# EAGLE board stm32 v1.0 (EAGLE 9.6.2), part 1 of 2
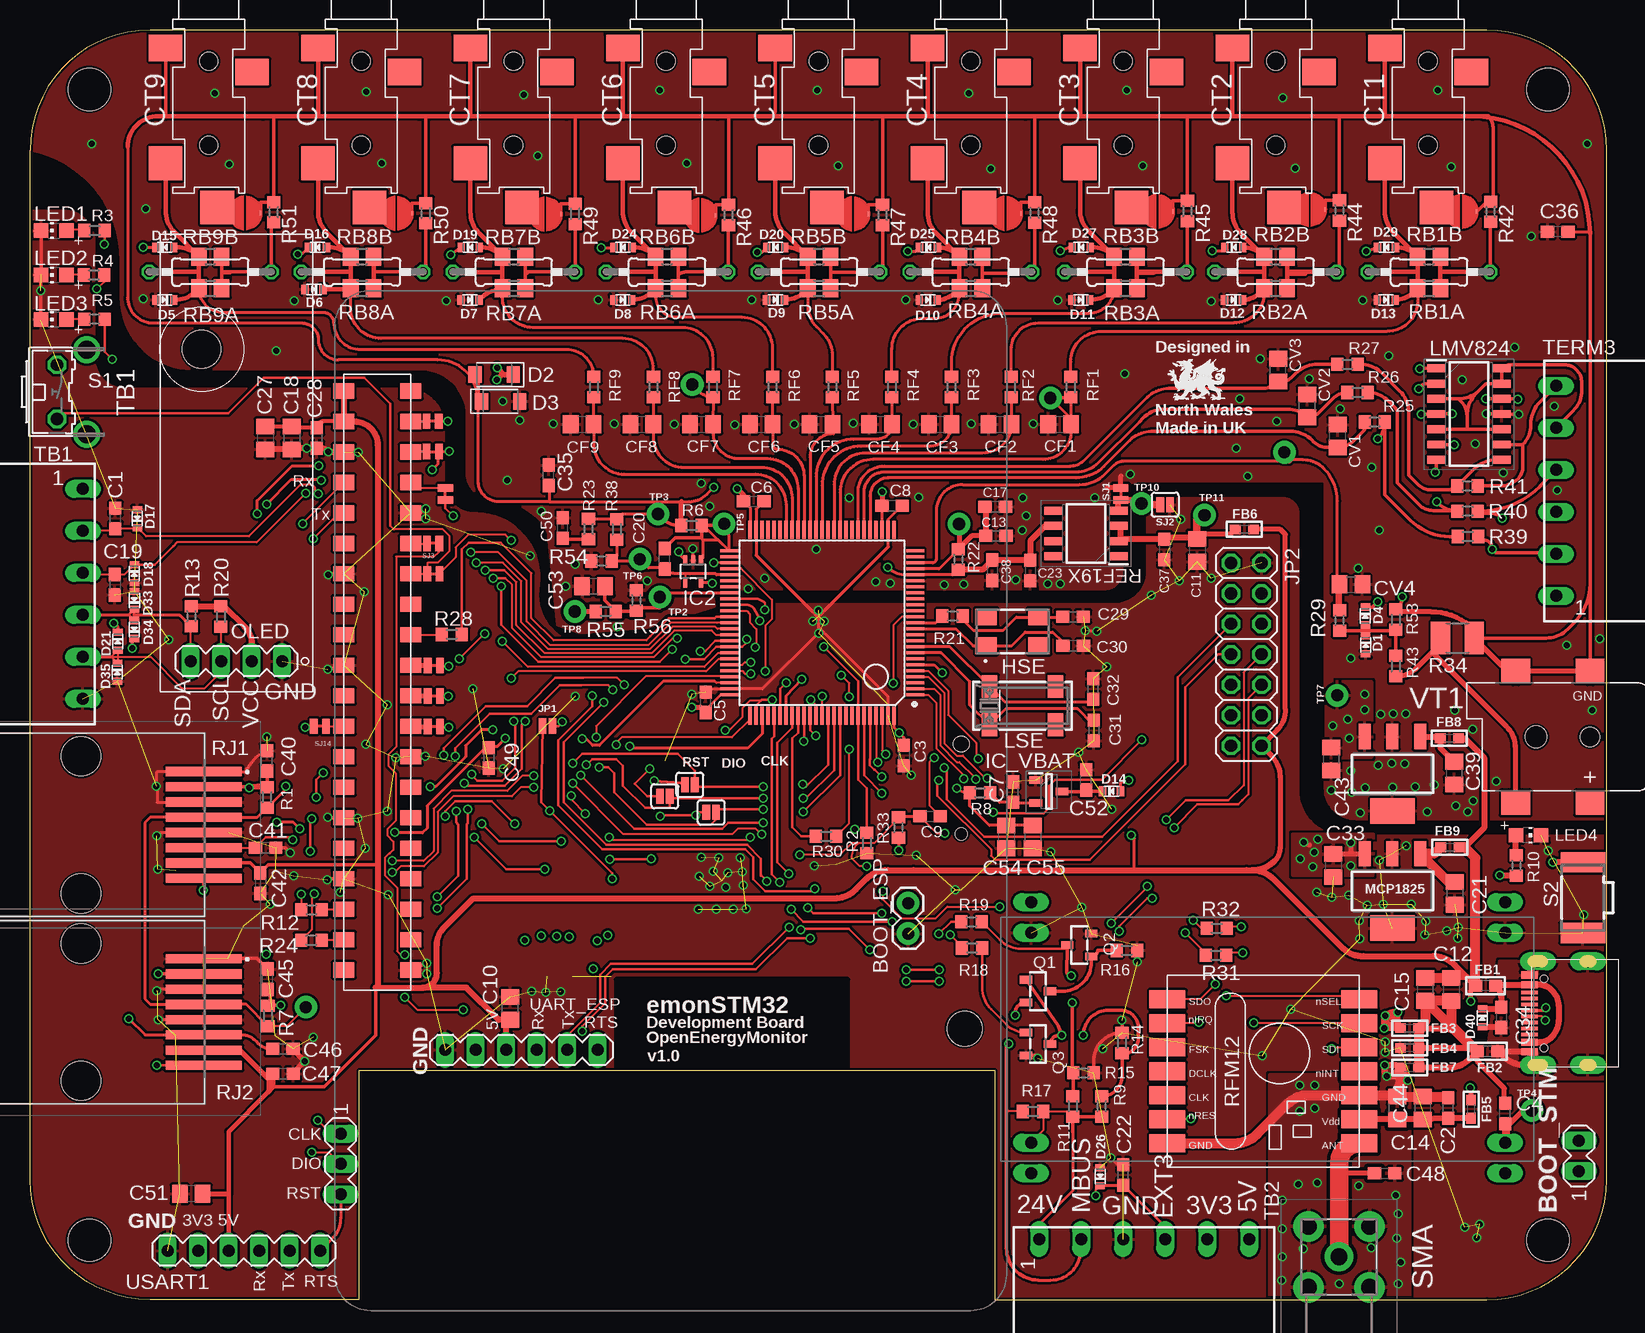
[diagram p5: board, top side]
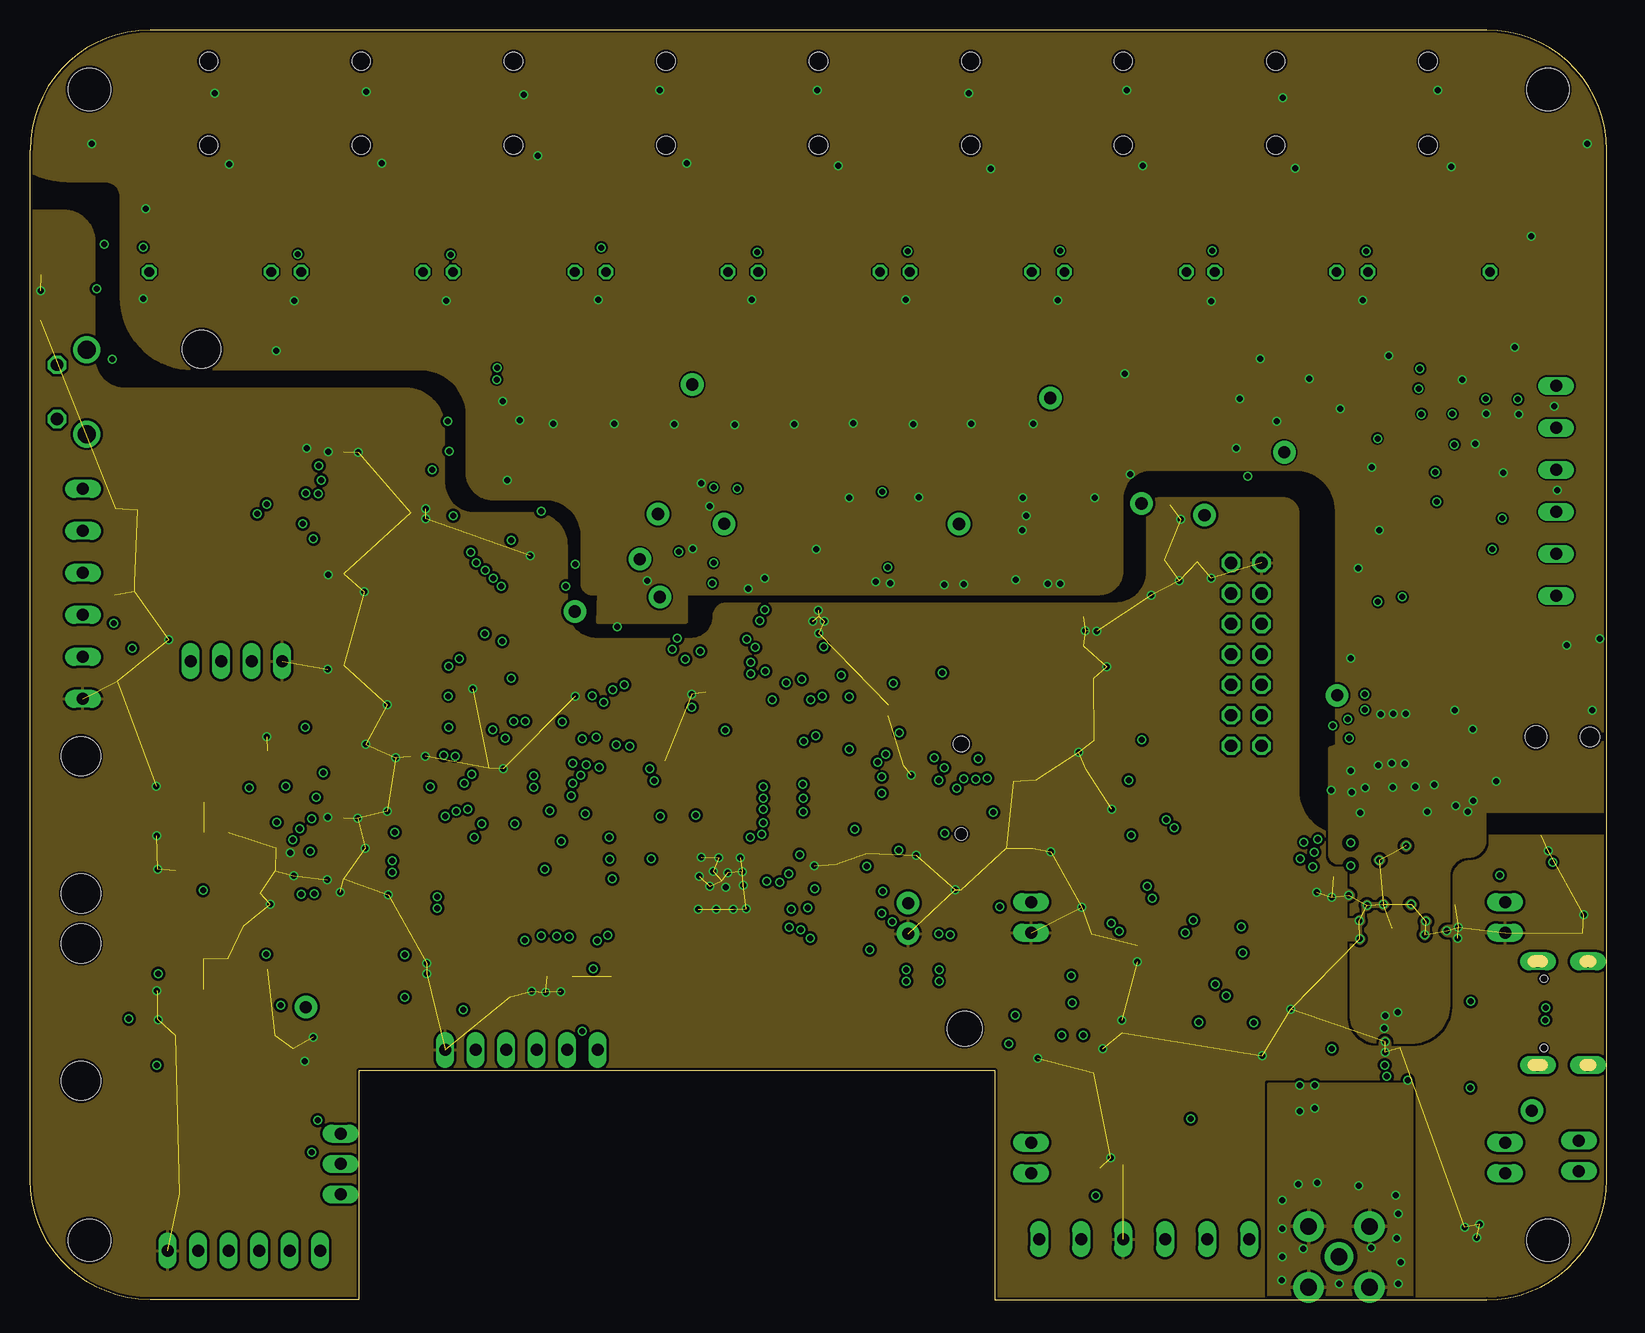
[diagram p6: board, inner layer GND]
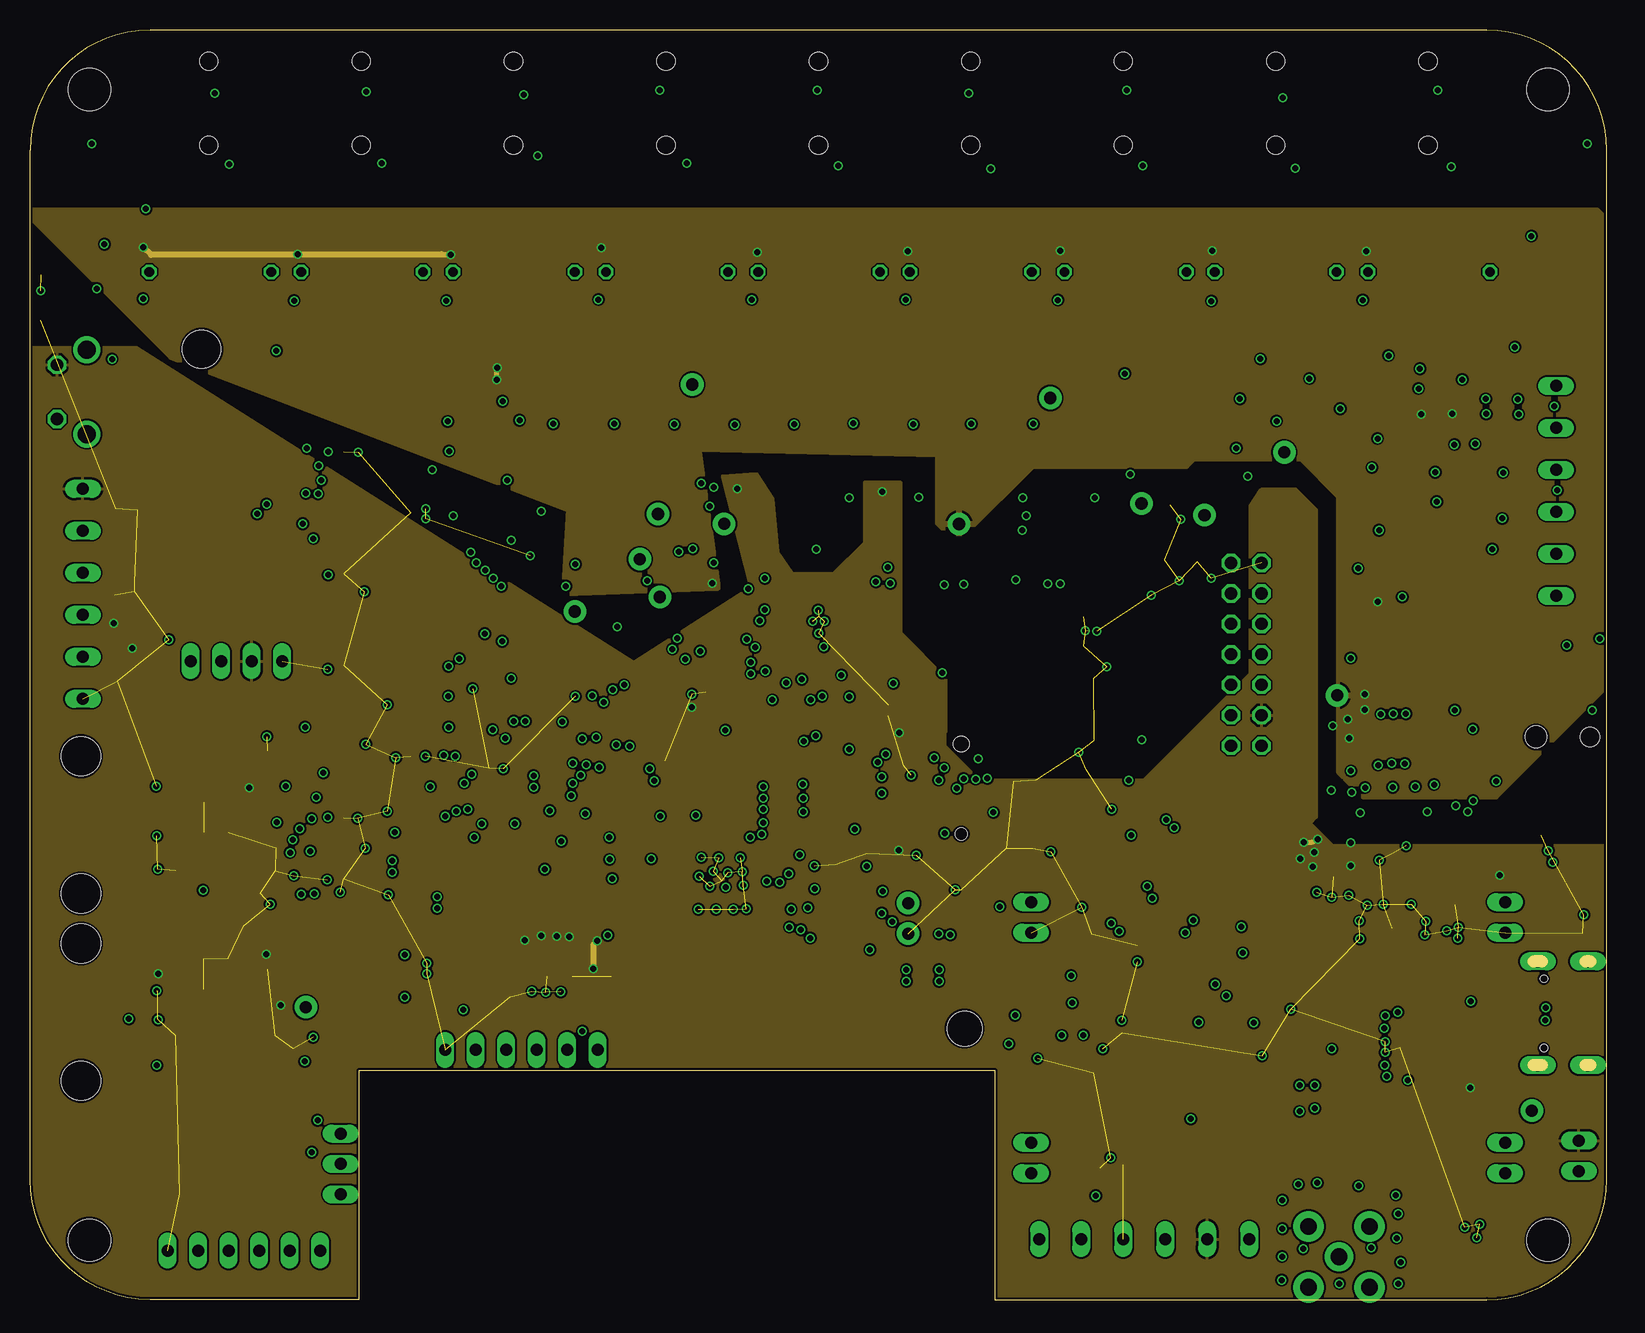
[diagram p7: board, inner layer +3V3]
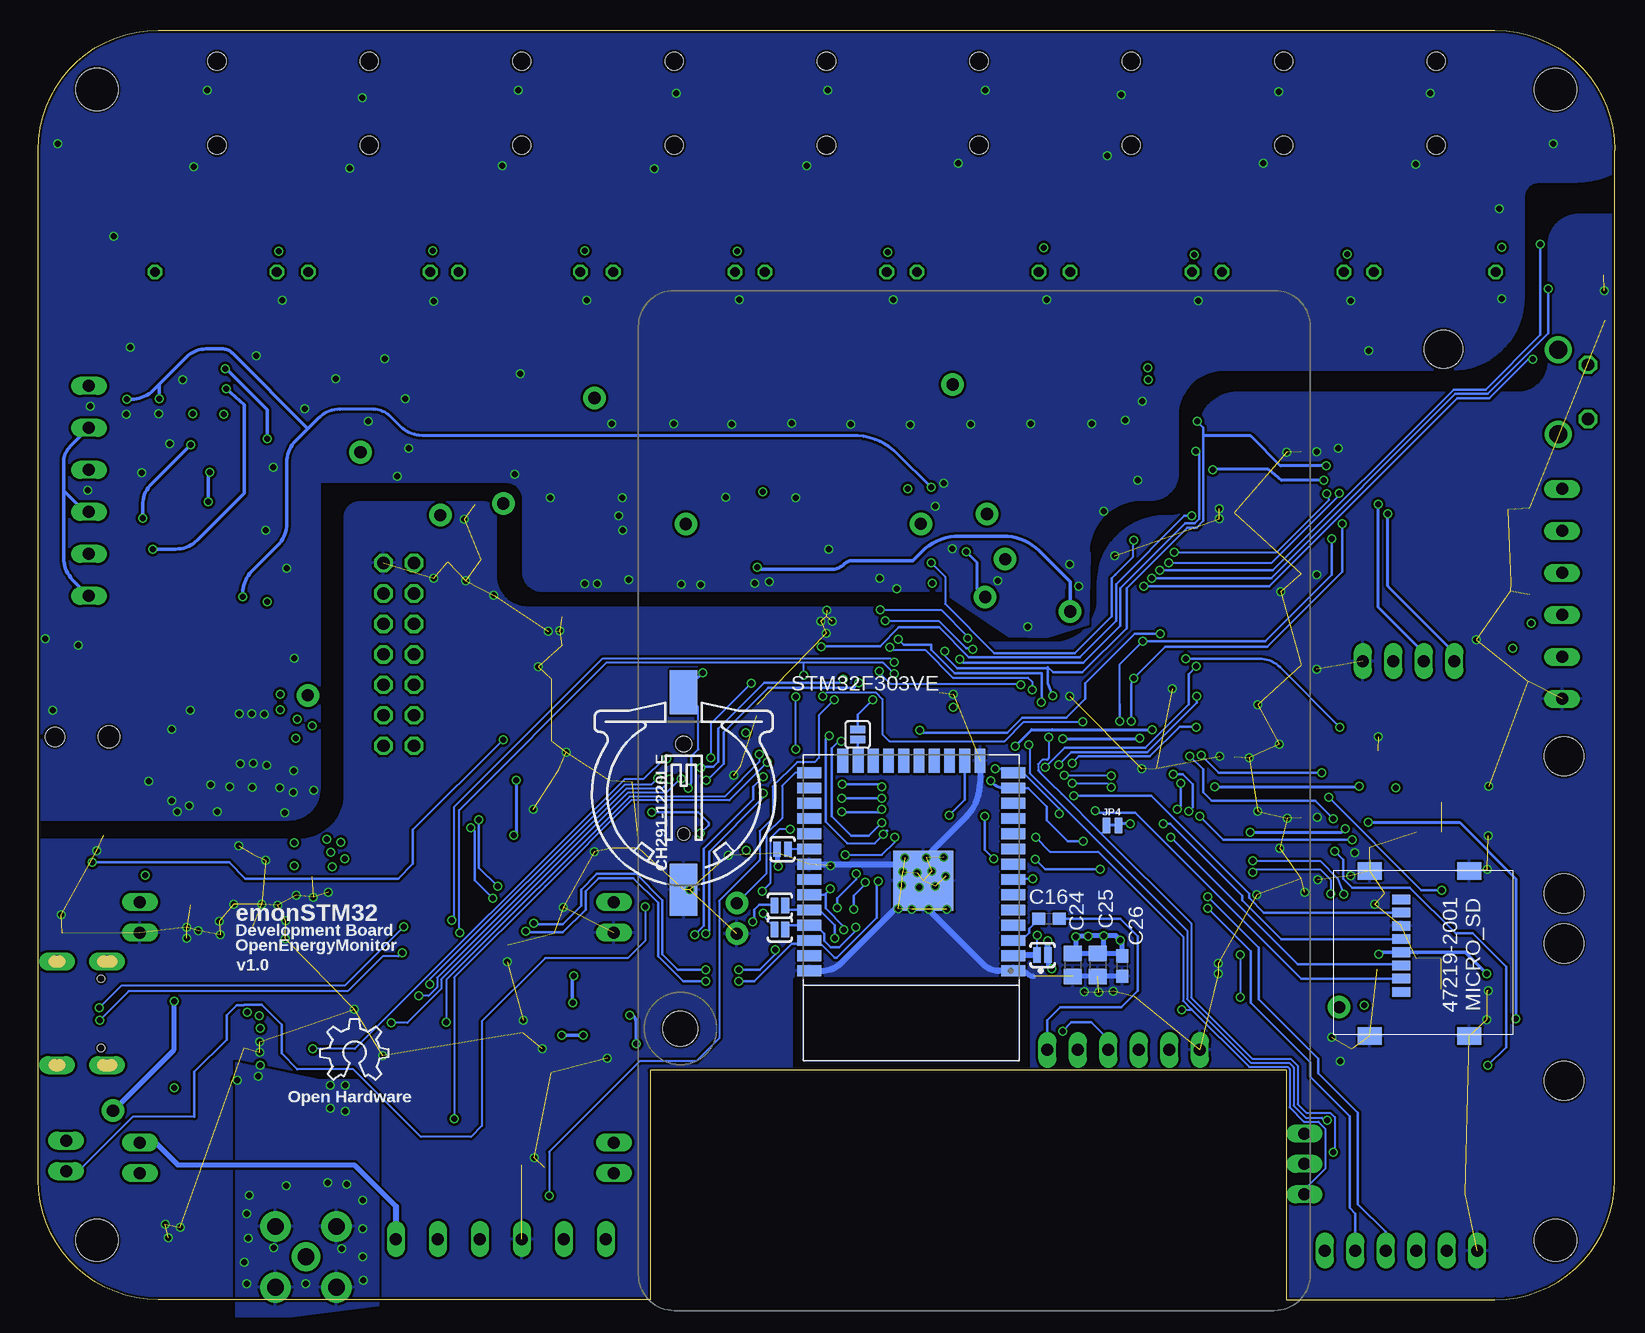
[diagram p8: board, bottom side, seen from below]

Size 131.4 x 105.8 mm. Coordinates in mm from the lower left corner, seen from the top.
Outline: 131.4,10 131.4,95.8 arc90 121.4,105.8 10,105.8 arc90 0,95.8 0,10 arc90 10,0 27.4,0 27.4,19.1 80.4,19.1 80.4,0 121.4,0 arc90 131.4,10
Copper layers (1+2*15+16): Top 0.035mm / dielectric 0.2mm / GND 0.018mm / dielectric 1.1mm / +3V3 0.018mm / dielectric 0.2mm / Bottom 0.035mm
Design rules "ragworm *": minimum track width 7mil, minimum drill 0.5mm, track to track 6mil, track to pad 6mil, pad to pad 7mil, via to via 8mil, smd to smd 0mil, copper to edge 8mil, drill to drill 10mil, minimum pad ring 3mil, minimum via ring 3mil, stop-mask expansion 2mil, vias tented up to drill 25mil, thermal gap 8mil
Net classes: 0 default: width 0.178 mm, drill 0.5 mm, clearance 0.152 mm; 1 power: width 0.254 mm, drill 0.5 mm, clearance 0.152 mm; 2 gnd: width 0.254 mm, drill 0.5 mm, clearance 0.152 mm; 3 ant: width 0.406 mm, drill 0.5 mm, clearance 0.254 mm; 4 cts_vts: width 0.254 mm, drill 0.5 mm, clearance 0.229 mm
Holes 3.5 mm at 126.5,100.85 4.95,100.85 4.95,4.95 126.5,4.95
Holes 3.18 mm at 14.3,79.2
tRestrict: area 48.8,18.3 to 68.2,26.7
bRestrict: area 49,18.3 to 68.3,26.7

## Footprints (pad centres in the part's own frame; a part is rotated, then mirrored left to right if it is on the bottom)
1X02 = drill 1.016 pad 1.88: 1 0,0; 2 2.54,0
MA02-1 = drill 1 long: 1 -2.54,0; 2 0,0
C0603 = smd 1.1 x 1: 1 -0.85,0; 2 0.85,0
C0805 = smd 1.3 x 1.5: 1 -0.95,0; 2 0.95,0
SJ-352X-SMT = smd 2.8 x 2.2: P$1 -3.6,-2.4; P$3 3.6,-4.4 | smd 2.8 x 2.8: P$2 -3.6,-12; P$4 0.7,-15.7 | hole 1.5: 0,-3.5; 0,-10.5
SOD-523 = smd 0.8 x 0.6: A 0,-0.75; K 0,0.75
SODFL3718X115 = smd 1.115 x 1.361: 1 -1.6,0; 2 1.6,0
0603 = smd 1.1 x 1: 1 -0.85,0; 2 0.85,0
_0603 = smd 0.9 x 0.8: 1 -0.762,0; 2 0.762,0
CH291-1220LF = smd 2.3 x 3.66: + 0,-2.296 | smd 2.3 x 4.3: - 0,14.146 | hole 1.3: 0,2 | hole 1: 0,9.5
ABMM2 = smd 1.8 x 1.4: 1 -2.2,-1.2; 2 2.2,-1.2; 3 2.2,1.2; 4 -2.2,1.2
SC70-5 = smd 0.35 x 0.8: 1 -0.65,-0.95; 2 0,-0.95; 3 0.65,-0.95; 4 0.65,0.95; 5 -0.65,0.95
SOT96P240X135-3N = smd 1.05 x 0.65: 1 -1.1,0.96; 2 -1.1,-0.96; 3 1.1,0
SMT-JUMPER_2_NC_TRACE_NO-SILK = smd 0.635 x 1.27: 1 -0.508,0; 2 0.508,0
SMT-JUMPER_2_NO_NO-SILK = smd 0.635 x 1.27: 1 -0.406,0; 2 0.406,0
2X07 = drill 1.016 octagon: 1 -7.62,-1.27; 2 -7.62,1.27; 3 -5.08,-1.27; 4 -5.08,1.27; 5 -2.54,-1.27; 6 -2.54,1.27; 7 0,-1.27; 8 0,1.27; 9 2.54,-1.27; 10 2.54,1.27; 11 5.08,-1.27; 12 5.08,1.27; 13 7.62,-1.27; 14 7.62,1.27
SMT-JUMPER_2_NO_NO-SILK_ROUND = smd 0.152 x 0.305: 1 -1.27,0; 2 1.27,0
CHIP-LED0805 = smd 1.2 x 1.2: A 0,-1.05; C 0,1.05
SOIC127P600X175-14N = smd 1.525 x 0.65: 1 -2.712,3.81; 2 -2.712,2.54; 3 -2.712,1.27; 4 -2.712,0; 5 -2.712,-1.27; 6 -2.712,-2.54; 7 -2.712,-3.81; 8 2.712,-3.81; 9 2.712,-2.54; 10 2.712,-1.27; 11 2.712,0; 12 2.712,1.27; 13 2.712,2.54; 14 2.712,3.81
CRYSTAL_8X3.8 = smd 1.3 x 1.9: P$1 -2.75,-1.6; P$2 2.75,-1.6; P$3 2.75,1.6; P$4 -2.75,1.6
SOT-223 = smd 1 x 2.1: 1 -2.3,-3.1; 2 0,-3.1; 3 2.3,-3.1 | smd 3.7 x 2.1: 4 0,3.1
MA04-1-OLED = drill 1 long: 1 -3.81,0; 2 -1.27,0; 3 1.27,0; 4 3.81,0
RPI3MIRROR2 = smd 1.27 x 1.778: P$41 8.371,6.351; P$42 8.371,0.763; P$43 10.911,6.351; P$44 10.911,0.763; P$45 13.451,6.351; P$46 13.451,0.763; P$47 15.991,6.351; P$48 15.991,0.763; P$49 18.531,6.351; P$50 18.531,0.763; P$51 21.071,6.351; P$52 21.071,0.763; P$53 23.611,6.351; P$54 23.611,0.763; P$55 26.151,6.351; P$56 26.151,0.763; P$57 28.691,6.351; P$58 28.691,0.763; P$59 31.231,6.351; P$60 31.231,0.763; P$61 33.771,6.351; P$62 33.771,0.763; P$63 36.311,6.351; P$64 36.311,0.763; P$65 38.851,6.351; P$66 38.851,0.763; P$67 41.391,6.351; P$68 41.391,0.763; P$69 43.931,6.351; P$70 43.931,0.763; P$71 46.471,6.351; P$72 46.471,0.763; P$73 49.011,6.351; P$74 49.011,0.763; P$75 51.551,6.351; P$76 51.551,0.763; P$77 54.091,6.351; P$78 54.091,0.763; P$79 56.631,6.351; P$80 56.631,0.763 | hole 2.9: 61.5,52.505
SOT23-R = smd 0.635 x 1.016: 1 -0.95,-1; 2 0.95,-1; 3 0,1
R0603 = smd 1 x 1.1: 1 -0.85,0; 2 0.85,0
R1210 = smd 1.6 x 2.7: 1 -1.4,0; 2 1.4,0
0207/10 = drill 0.813 octagon: 1 -5.08,0; 2 5.08,0
R0805 = smd 1.3 x 1.5: 1 -0.95,0; 2 0.95,0
SOIC127P599X175-8N = smd 1.526 x 0.65: 1 -2.712,1.905; 2 -2.712,0.635; 3 -2.712,-0.635; 4 -2.712,-1.905; 5 2.712,-1.905; 6 2.712,-0.635; 7 2.712,0.635; 8 2.712,1.905
RFM12 = smd 1.5 x 3: 1 -5,-10; 2 -3,-10; 3 -1,-10; 4 1,-10; 5 3,-10; 6 5,-10; 7 7,-10; 8 7,6; 9 5,6; 10 3,6; 11 1,6; 12 -1,6; 13 -3,6; 14 -5,6
955016889 = smd 0.76 x 6.35: 1 -4.445,8.975; 2 -3.175,8.975; 3 -1.905,8.975; 4 -0.635,8.975; 5 0.635,8.975; 6 1.905,8.975; 7 3.175,8.975; 8 4.445,8.975 | hole 3.25: -5.715,-1.25; 5.715,-1.25
B3F-31XX = drill 1.016 octagon: 1 -2.261,-1.245; 2 2.261,-1.245 | drill 1.499 pad 2.159: 3 -3.505,1.245; 4 3.505,1.245
KSS = smd 1.7 x 3.7: 1 -2.95,0; 2 2.95,0
SMT-JUMPER_2_NO_SILK = smd 0.635 x 1.27: 1 -0.406,0; 2 0.406,0
SJ_2S-NO = smd 0.635 x 1.27: 1 -0.45,0; 2 0.45,0
518144001 = drill 1.4 pad 2.4: 1 0,0 | drill 1.4 pad 2.55: 2 -2.54,2.54; 3 -2.54,-2.54; 4 2.54,-2.54; 5 2.54,2.54
TQFP100 = smd 0.27 x 1.5: 1 -6,-7.75; 2 -5.5,-7.75; 3 -5,-7.75; 4 -4.5,-7.75; 5 -4,-7.75; 6 -3.5,-7.75; 7 -3,-7.75; 8 -2.5,-7.75; 9 -2,-7.75; 10 -1.5,-7.75; 11 -1,-7.75; 12 -0.5,-7.75; 13 0,-7.75; 14 0.5,-7.75; 15 1,-7.75; 16 1.5,-7.75; 17 2,-7.75; 18 2.5,-7.75; 19 3,-7.75; 20 3.5,-7.75; 21 4,-7.75; 22 4.5,-7.75; 23 5,-7.75; 24 5.5,-7.75; 25 6,-7.75; 51 6,7.75; 52 5.5,7.75; 53 5,7.75; 54 4.5,7.75; 55 4,7.75; 56 3.5,7.75; 57 3,7.75; 58 2.5,7.75; 59 2,7.75; 60 1.5,7.75; 61 1,7.75; 62 0.5,7.75; 63 0,7.75; 64 -0.5,7.75; 65 -1,7.75; 66 -1.5,7.75; 67 -2,7.75; 68 -2.5,7.75; 69 -3,7.75; 70 -3.5,7.75; 71 -4,7.75; 72 -4.5,7.75; 73 -5,7.75; 74 -5.5,7.75; 75 -6,7.75 | smd 1.5 x 0.27: 26 7.75,-6; 27 7.75,-5.5; 28 7.75,-5; 29 7.75,-4.5; 30 7.75,-4; 31 7.75,-3.5; 32 7.75,-3; 33 7.75,-2.5; 34 7.75,-2; 35 7.75,-1.5; 36 7.75,-1; 37 7.75,-0.5; 38 7.75,0; 39 7.75,0.5; 40 7.75,1; 41 7.75,1.5; 42 7.75,2; 43 7.75,2.5; 44 7.75,3; 45 7.75,3.5; 46 7.75,4; 47 7.75,4.5; 48 7.75,5; 49 7.75,5.5; 50 7.75,6; 76 -7.75,6; 77 -7.75,5.5; 78 -7.75,5; 79 -7.75,4.5; 80 -7.75,4; 81 -7.75,3.5; 82 -7.75,3; 83 -7.75,2.5; 84 -7.75,2; 85 -7.75,1.5; 86 -7.75,1; 87 -7.75,0.5; 88 -7.75,0; 89 -7.75,-0.5; 90 -7.75,-1; 91 -7.75,-1.5; 92 -7.75,-2; 93 -7.75,-2.5; 94 -7.75,-3; 95 -7.75,-3.5; 96 -7.75,-4; 97 -7.75,-4.5; 98 -7.75,-5; 99 -7.75,-5.5; 100 -7.75,-6
MA06-1 = drill 1 long: 1 -6.35,0; 2 -3.81,0; 3 -1.27,0; 4 1.27,0; 5 3.81,0; 6 6.35,0
MA03-1 = drill 1 long: 1 -2.54,0; 2 0,0; 3 2.54,0
3.5MM_X6 = drill 1 long: P$1 3,8.75; P$2 3,5.25; P$3 3,1.75; P$4 3,-1.75; P$5 3,-5.25; P$6 3,-8.75
1X01_NO_SILK = drill 1.016 pad 1.88: 1 0,0
MODULE_ESP32-WROOM-32D = smd 2 x 0.9: 1 -8.5,5.26; 2 -8.5,3.99; 3 -8.5,2.72; 4 -8.5,1.45; 5 -8.5,0.18; 6 -8.5,-1.09; 7 -8.5,-2.36; 8 -8.5,-3.63; 9 -8.5,-4.9; 10 -8.5,-6.17; 11 -8.5,-7.44; 12 -8.5,-8.71; 13 -8.5,-9.98; 14 -8.5,-11.25; 25 8.5,-11.25; 26 8.5,-9.98; 27 8.5,-8.71; 28 8.5,-7.44; 29 8.5,-6.17; 30 8.5,-4.9; 31 8.5,-3.63; 32 8.5,-2.36; 33 8.5,-1.09; 34 8.5,0.18; 35 8.5,1.45; 36 8.5,2.72; 37 8.5,3.99; 38 8.5,5.26 | smd 0.9 x 2: 15 -5.715,-12.25; 16 -4.445,-12.25; 17 -3.175,-12.25; 18 -1.905,-12.25; 19 -0.635,-12.25; 20 0.635,-12.25; 21 1.905,-12.25; 22 3.175,-12.25; 23 4.445,-12.25; 24 5.715,-12.25 | smd 5 x 5: 39 -1,-2.24
BOOST = drill 1 long: IN+ 17.5,39.5; IN+1 20.04,39.5; OUT+ 17.5,0; OUT+1 20.04,0; P$1 0,0; P$2 0,39.5; P$3 -2.54,0; P$4 -2.54,39.5
47219-2001_MICROSD = smd 1.45 x 2: P$1 0,0; P$2 13.75,0; P$3 0,8.3; P$4 13.75,8.3 | smd 0.8 x 1.5: PIN1 10.08,2.6; PIN2 8.98,2.6; PIN3 7.88,2.6; PIN4 6.78,2.6; PIN5 5.68,2.6; PIN6 4.58,2.6; PIN7 3.48,2.6; PIN8 2.38,2.6
USB-C = smd 0.6 x 1.4: A1/B12 -3.2,0.7; A4/B9 -2.4,0.7; B1/A12 3.2,0.7; B4/A9 2.4,0.7 | smd 0.3 x 1.4: A5 -1.25,0.7; A6 -0.25,0.7; A7 0.25,0.7; A8 1.25,0.7; B5 1.75,0.7; B6 0.75,0.7; B7 -0.75,0.7; B8 -1.75,0.7 | drill 1 pad 1.2 long: GND1 -4.32,0; GND2 4.33,0; GND3 4.33,-4.18; GND4 -4.32,-4.18 | hole 0.6: -2.89,-0.5; 2.89,-0.5
DCJACK_2MM_SMT = smd 2.4 x 2: GND 0,-5.5; GNDBREAK 6.2,-5.5; PWR1 0,5.5; PWR2 6.2,5.5 | hole 1.6: 0,0 | hole 1.8: 4.5,0

## Placement (x,y rotation side)
BOOT_ESP  [1X02]  73.18,30.5 90 top
BOOT_STM  [MA02-1]  129.07,13.25 90 top
C1  100nF  [C0603]  7.12,65.08 90 top
C2  100nF  [C0603]  118.19,15.97 90 top
C3  100nF  [C0603]  72.83,45.33 270 top
C4  100nF  [C0603]  122.93,15.5 90 top
C5  100nF  [C0603]  56.33,49.77 90 top
C6  100nF  [C0603]  60.31,66.53 0 top
C7  1uF  [C0603]  81.93,42.29 90 top
C8  100nF  [C0603]  71.85,66.17 0 top
C9  1uF  [C0603]  75.02,40.27 0 top
C10  2.2uF  [C0805]  40.03,24.27 90 top
C11  22uF  [C0805]  97.27,62.44 270 top
C12  22uF  [C0805]  118.45,25.84 270 top
C13  2.2uF  [C0603]  80.48,63.65 0 top
C14  22uF  [C0805]  113.92,15.97 90 top
C15  2.2uF  [C0805]  116.25,25.85 270 top
C16  100nF  [C0603]  47.17,31.73 180 bottom
C17  100nF  [C0603]  80.44,66.08 0 top
C18  22uF  [C0805]  21.8,71.8 270 top
C19  100nF  [C0603]  7.08,59.57 270 top
C20  2.2nF  [C0603]  52.89,61.73 90 top
C21  22uF  [C0805]  118.72,33.85 270 top
C22  100nF  [C0603]  91.11,10.38 90 top
C23  1uF  [C0603]  83.36,60.76 270 top
C24  2.2uF  [C0805]  45.19,27.88 270 bottom
C25  2.2uF  [C0805]  43.1,27.88 270 bottom
C26  100nF  [C0603]  41.08,27.79 270 bottom
C27  2.2uF  [C0805]  19.6,71.8 270 top
C28  100nF  [C0603]  23.9,71.8 270 top
C29  15pF  [C0603]  86.92,56.91 0 top
C30  15pF  [C0603]  86.93,54.5 0 top
C31  10pF  [C0603]  88.63,47.43 270 top
C32  10pF  [C0603]  88.62,50.89 90 top
C33  22uF  [C0805]  108.61,36.18 270 top
C34  100nF  [C0603]  122.61,23.52 270 top
C35  [C0603]  43.22,68.7 90 top
C36  [C0603]  127.31,88.98 180 top
C37  100nF  [C0603]  94.53,62.51 270 top
C38  100nF  [C0603]  80.18,60.78 270 top
C39  22uF  [C0805]  118.67,43.87 270 top
C40  100nF  [C0603]  19.75,44.9 90 top
C41  100nF  [C0603]  19.64,37.67 0 top
C42  100nF  [C0603]  19.2,34.7 270 top
C43  22uF  [C0805]  108.42,45.05 270 top
C44  22uF  [C0805]  116.08,15.97 90 top
C45  100nF  [C0603]  19.8,26.7 90 top
C46  100nF  [C0603]  21.07,20.89 0 top
C47  100nF  [C0603]  21.08,18.84 0 top
C48  [C0603]  112.89,10.52 0 top
C49  100nF  [C0603]  38.22,45.15 270 top
C50  1uF  [C0603]  44.41,64.3 90 top
C51  22uF  [C0805]  13.44,8.82 180 top
C52  1uF  [C0603]  88,43.31 90 top
C53  22uF  [C0805]  46.97,59.43 180 top
C54  47uF  [C0805]  81.36,38.56 270 top
C55  47uF  [C0805]  83.55,38.56 270 top
CF1  10nF 5%  [C0805]  85.8,72.95 0 top
CF2  10nF 5%  [C0805]  80.83,72.95 0 top
CF3  10nF 5%  [C0805]  75.86,72.95 0 top
CF4  10nF 5%  [C0805]  70.88,72.95 0 top
CF5  10nF 5%  [C0805]  65.91,72.95 0 top
CF6  10nF 5%  [C0805]  60.94,72.95 0 top
CF7  10nF 5%  [C0805]  55.96,72.95 0 top
CF8  10nF 5%  [C0805]  50.99,72.95 0 top
CF9  10nF 5%  [C0805]  46.02,72.95 0 top
CT1  SJ-3523-SMT  [SJ-352X-SMT]  116.5,106.7 0 top
CT2  SJ-3523-SMT  [SJ-352X-SMT]  103.8,106.7 0 top
CT3  SJ-3523-SMT  [SJ-352X-SMT]  91.1,106.7 0 top
CT4  SJ-3523-SMT  [SJ-352X-SMT]  78.4,106.7 0 top
CT5  SJ-3523-SMT  [SJ-352X-SMT]  65.7,106.7 0 top
CT6  SJ-3523-SMT  [SJ-352X-SMT]  53,106.7 0 top
CT7  SJ-3523-SMT  [SJ-352X-SMT]  40.3,106.7 0 top
CT8  SJ-3523-SMT  [SJ-352X-SMT]  27.6,106.7 0 top
CT9  SJ-3523-SMT  [SJ-352X-SMT]  14.9,106.7 0 top
CV1  10nF 5%  [C0805]  108.97,71.97 90 top
CV2  10nF 5%  [C0805]  106.43,74.48 90 top
CV3  10nF 5%  [C0805]  104,77.45 90 top
CV4  10nF 5%  [C0805]  110.09,59.59 0 top
D1  ESD5Z3.3T1G  [SOD-523]  111.3,54.56 0 top
D2  SCHOTTKY_MBR0520LT1GDO-219-AB(SOD123F)  [SODFL3718X115]  38.68,77.08 180 top
D3  SCHOTTKY_MBR0520LT1GDO-219-AB(SOD123F)  [SODFL3718X115]  39.21,74.85 0 top
D4  ESD5Z3.3T1G  [SOD-523]  111.28,56.96 0 top
D5  ESD5Z3.3T1G  [SOD-523]  11.23,83.31 270 top
D6  ESD5Z3.3T1G  [SOD-523]  23.66,84.18 270 top
D7  ESD5Z3.3T1G  [SOD-523]  36.67,83.31 270 top
D8  ESD5Z3.3T1G  [SOD-523]  49.4,83.31 270 top
D9  ESD5Z3.3T1G  [SOD-523]  62.12,83.31 270 top
D10  ESD5Z3.3T1G  [SOD-523]  74.84,83.31 270 top
D11  ESD5Z3.3T1G  [SOD-523]  87.57,83.31 270 top
D12  ESD5Z3.3T1G  [SOD-523]  100.29,83.31 270 top
D13  ESD5Z3.3T1G  [SOD-523]  113.01,83.31 270 top
D14  ESD5Z3.3T1G  [SOD-523]  90.13,42.36 90 top
D15  ESD5Z3.3T1G  [SOD-523]  11.23,87.69 90 top
D16  ESD5Z3.3T1G  [SOD-523]  23.96,87.69 90 top
D17  ESD5Z3.3T1G  [SOD-523]  8.95,65.08 180 top
D18  ESD5Z3.3T1G  [SOD-523]  8.69,60.5 0 top
D19  ESD5Z3.3T1G  [SOD-523]  36.69,87.69 90 top
D20  ESD5Z3.3T1G  [SOD-523]  62.14,87.69 90 top
D21  ESD5Z3.3T1G  [SOD-523]  8.69,55.84 180 top
D24  ESD5Z3.3T1G  [SOD-523]  49.41,87.69 90 top
D25  ESD5Z3.3T1G  [SOD-523]  74.87,87.69 90 top
D26  ESD5Z3.3T1G  [SOD-523]  89.18,10.25 180 top
D27  ESD5Z3.3T1G  [SOD-523]  87.59,87.69 90 top
D28  ESD5Z3.3T1G  [SOD-523]  100.32,87.69 90 top
D29  ESD5Z3.3T1G  [SOD-523]  113.05,87.69 90 top
D33  ESD5Z3.3T1G  [SOD-523]  8.71,58.27 180 top
D34  ESD5Z3.3T1G  [SOD-523]  7.32,54.85 0 top
D35  ESD5Z3.3T1G  [SOD-523]  7.28,52.28 0 top
D40  ESD5Z5.0T1G  [SOD-523]  121.03,23.48 0 top
FB1  [0603]  121.31,26.16 180 top
FB2  [0603]  121.46,20.68 180 top
FB3  [_0603]  114.97,22.62 180 top
FB4  [_0603]  114.97,20.98 180 top
FB5  [_0603]  120.1,15.87 90 top
FB6  [_0603]  101.2,64.19 0 top
FB7  [_0603]  114.97,19.34 180 top
FB8  [_0603]  118.29,46.78 0 top
FB9  [_0603]  118.32,37.7 0 top
G1  CH291-1220LF  [CH291-1220LF]  77.61,48.3 180 bottom
HSE  6MM_3.5MM_CRYSTAL  [ABMM2]  81.88,55.68 0 top
IC2  AD8519KS  [SC70-5]  55.26,60.68 180 top
IC_VBAT  AP7313-33SRG-7  [SOT96P240X135-3N]  84.91,42.34 0 top
J1  JUMPER-SMT_2_NC_TRACE_NO-SILK  [SMT-JUMPER_2_NC_TRACE_NO-SILK]  34.62,67.13 90 top
JP1  JUMPER-SMT_2_NO_NO-SILK  [SMT-JUMPER_2_NO_NO-SILK]  43.13,47.8 0 top
JP2  PINHD-2X7  [2X07]  101.36,53.77 270 top
JP4  JUMPER-SMT_2_NC_TRACE_NO-SILK  [SMT-JUMPER_2_NC_TRACE_NO-SILK]  41.87,39.52 180 bottom
JP10  JUMPER-SMT_2_NO_NO-SILK_ROUND  [SMT-JUMPER_2_NO_NO-SILK_ROUND]  119.28,90.67 180 top
JP11  JUMPER-SMT_2_NO_NO-SILK_ROUND  [SMT-JUMPER_2_NO_NO-SILK_ROUND]  81.31,90.52 180 top
JP12  JUMPER-SMT_2_NO_NO-SILK_ROUND  [SMT-JUMPER_2_NO_NO-SILK_ROUND]  106.66,90.85 180 top
JP13  JUMPER-SMT_2_NO_NO-SILK_ROUND  [SMT-JUMPER_2_NO_NO-SILK_ROUND]  68.6,90.48 180 top
JP14  JUMPER-SMT_2_NO_NO-SILK_ROUND  [SMT-JUMPER_2_NO_NO-SILK_ROUND]  93.98,90.68 180 top
JP15  JUMPER-SMT_2_NO_NO-SILK_ROUND  [SMT-JUMPER_2_NO_NO-SILK_ROUND]  55.87,90.37 180 top
JP16  JUMPER-SMT_2_NO_NO-SILK_ROUND  [SMT-JUMPER_2_NO_NO-SILK_ROUND]  17.94,90.55 180 top
JP17  JUMPER-SMT_2_NO_NO-SILK_ROUND  [SMT-JUMPER_2_NO_NO-SILK_ROUND]  30.55,90.53 180 top
JP18  JUMPER-SMT_2_NO_NO-SILK_ROUND  [SMT-JUMPER_2_NO_NO-SILK_ROUND]  42.97,90.46 180 top
LED1  Green 1.85V  [CHIP-LED0805]  1.98,89.08 90 top
LED2  Orange 1.85V  [CHIP-LED0805]  1.98,85.38 90 top
LED3  Red 1.85V  [CHIP-LED0805]  1.98,81.68 90 top
LED4  Green 1.85V  [CHIP-LED0805]  124.88,38.69 270 top
LMV824  LMV824IDG4  [SOIC127P600X175-14N]  119.92,73.79 0 top
LOGO1  OSHW_LOGO_6MILX0200-NT  [OSHW_6X200_NOTEXT]  107.87,18.31 0 bottom
LSE  32.768kHz  [CRYSTAL_8X3.8]  82.71,49.5 0 top
MCP1825  MCP1825SOT-223-3  [SOT-223]  113.54,34.06 180 top
MCP1825(ANALOG)  MCP1825SOT-223-3  [SOT-223]  113.54,43.82 180 top
OLED  [MA04-1-OLED]  17.2,53.2 0 top
PCB2  RPI3YA  [RPI3MIRROR2]  25.38,84.09 270 top
Q1  PNP  [SOT23-R]  84,25.7 270 top
Q2  NPN  [SOT23-R]  87.44,29.55 90 top
Q3  NPN  [SOT23-R]  84,21.3 270 top
R1  4.7k  [R0603]  19.75,41.85 90 top
R2  10k  [R0603]  69.73,38.04 270 top
R3  330R  [R0603]  5.38,89.08 0 top
R4  330R  [R0603]  5.33,85.38 0 top
R5  330R  [R0603]  5.37,81.71 0 top
R6  0R  [R0603]  55.14,64.51 180 top
R7  4.7k  [R0603]  19.83,23.65 90 top
R8  10k  [R0603]  79.16,42.23 180 top
R9  39K  [R0603]  89.3,16.1 270 top
R10  330R  [R0603]  123.86,36.18 270 top
R11  33K  [R0603]  86.9,16.1 270 top
R12  10k  [R0603]  23.46,32.48 180 top
R13  10k  [R0603]  13.44,56.95 90 top
R14  22K  [R0603]  91,21.4 270 top
R15  3k3  [R0603]  87.8,18.9 180 top
R16  82R  [R0603]  91.4,29.1 180 top
R17  220K  [R0603]  83.58,15.68 0 top
R18  1k  [R0603]  78.5,29.3 180 top
R19  1k  [R0603]  78.46,31.48 180 top
R20  10k  [R0603]  15.9,56.91 90 top
R21  2k  [R0603]  76.88,56.96 0 top
R22  0R  [R0603]  77.36,61.68 270 top
R23  1k  [R0603]  46.54,64.22 90 top
R24  10k  [R0603]  23.45,29.95 180 top
R25  9k1 0.1%  [R0603]  112.07,73.13 180 top
R26  9k1 0.1%  [R0603]  110.64,75.59 180 top
R27  9k1 0.1%  [R0603]  109.79,77.94 180 top
R28  10k  [R0603]  35.15,55.43 180 top
R29  0R  [R0603]  109.14,56.6 90 top
R30  1k5  [R0603]  66.34,38.61 180 top
R31  20R  [R0603]  98.83,28.69 180 top
R32  20R  [R0603]  98.9,30.94 180 top
R33  10k  [R0603]  72.37,39.34 90 top
R34  [R1210]  118.95,55.12 0 top
R38  39k  [R0603]  48.91,64.19 270 top
R39  620R  [R0603]  119.82,63.59 0 top
R40  620R  [R0603]  119.81,65.7 0 top
R41  620R  [R0603]  119.79,67.81 180 top
R42  0R  [R0603]  121.73,90.65 270 top
R43  100k  [R0603]  113.82,52.78 270 top
R44  0R  [R0603]  109.12,90.77 270 top
R45  0R  [R0603]  96.45,90.71 270 top
R46  0R  [R0603]  58.22,90.38 270 top
R47  0R  [R0603]  71.04,90.38 270 top
R48  0R  [R0603]  83.72,90.58 270 top
R49  0R  [R0603]  45.43,90.47 270 top
R50  0R  [R0603]  32.98,90.53 270 top
R51  0R  [R0603]  20.3,90.61 270 top
R53  10k  [R0603]  113.82,56.66 90 top
R54  10k  [R0603]  47.63,61.55 180 top
R55  91k  [R0603]  47.98,57.35 180 top
R56  10k  [R0603]  50.52,58.27 270 top
RB1_  [0207/10]  116.59,85.64 0 top
RB1A  6R8  [R0805]  116.59,84.27 0 top
RB1B  [R0805]  116.59,86.92 0 top
RB2_  [0207/10]  103.8,85.64 0 top
RB2A  6R8  [R0805]  103.8,84.27 0 top
RB2B  [R0805]  103.8,86.92 0 top
RB3_  [0207/10]  91.3,85.64 0 top
RB3A  6R8  [R0805]  91.3,84.27 0 top
RB3B  [R0805]  91.3,86.92 0 top
RB4_  [0207/10]  78.4,85.64 0 top
RB4A  6R8  [R0805]  78.4,84.27 0 top
RB4B  [R0805]  78.4,86.92 0 top
RB5_  [0207/10]  65.76,85.64 0 top
RB5A  6R8  [R0805]  65.76,84.27 0 top
RB5B  [R0805]  65.76,86.92 0 top
RB6_  [0207/10]  53.09,85.64 0 top
RB6A  6R8  [R0805]  53.09,84.27 0 top
RB6B  [R0805]  53.09,86.92 0 top
RB7_  [0207/10]  40.32,85.64 0 top
RB7A  6R8  [R0805]  40.32,84.27 0 top
RB7B  [R0805]  40.32,86.92 0 top
RB8_  [0207/10]  27.68,85.64 0 top
RB8A  6R8  [R0805]  27.68,84.27 0 top
RB8B  [R0805]  27.68,86.92 0 top
RB9_  [0207/10]  15.02,85.64 0 top
RB9A  6R8  [R0805]  15.02,84.27 0 top
RB9B  [R0805]  15.02,86.92 0 top
REF19X  REF191ESZ  [SOIC127P599X175-8N]  88,63.84 180 top
RF1  9k1 0.1%  [R0603]  86.73,76.04 270 top
RF2  9k1 0.1%  [R0603]  81.76,76.04 270 top
RF3  9k1 0.1%  [R0603]  76.79,76.04 270 top
RF4  9k1 0.1%  [R0603]  71.82,76.04 270 top
RF5  9k1 0.1%  [R0603]  66.86,76.04 270 top
RF6  9k1 0.1%  [R0603]  61.89,76.04 270 top
RF7  9k1 0.1%  [R0603]  56.92,76.04 270 top
RF8  9k1 0.1%  [R0603]  51.95,76.04 270 top
RF9  9k1 0.1%  [R0603]  46.98,76.04 270 top
RFM69HCW  RFM12_SMDSMD  [RFM12]  104.78,20.03 270 top
RJ1  95501-6889  [955016889]  5.5,39.56 270 top
RJ2  95501-6889  [955016889]  5.5,23.96 270 top
S1  [B3F-31XX]  3.5,75.64 270 top
S2  KSS221GLFS  [KSS]  129.4,33.5 90 top
SJ1  JUMPER-SMT_2_NC_TRACE_NO-SILK  [SMT-JUMPER_2_NC_TRACE_NO-SILK]  90.91,67.13 270 top
SJ2  JUMPER-SMT_2_NO_SILK  [SMT-JUMPER_2_NO_SILK]  94.59,66.24 180 top
SJ3  JUMPER-SMT_2_NC_TRACE_NO-SILK  [SMT-JUMPER_2_NC_TRACE_NO-SILK]  33.61,60.48 0 top
SJ4  JUMPER-SMT_2_NO_SILK  [SMT-JUMPER_2_NO_SILK]  52.91,41.95 0 top
SJ5  JUMPER-SMT_2_NC_TRACE_NO-SILK  [SMT-JUMPER_2_NC_TRACE_NO-SILK]  33.66,52.83 180 top
SJ6  JUMPER-SMT_2_NC_TRACE_NO-SILK  [SMT-JUMPER_2_NC_TRACE_NO-SILK]  33.66,50.29 180 top
SJ7  JUMPER-SMT_2_NC_TRACE_NO-SILK  [SMT-JUMPER_2_NC_TRACE_NO-SILK]  33.66,47.75 180 top
SJ9  JUMPER-SMT_2_NO_SILK  [SMT-JUMPER_2_NO_SILK]  56.76,40.61 0 top
SJ10  JUMPER-SMT_2_NO_SILK  [SMT-JUMPER_2_NO_SILK]  54.98,42.9 0 top
SJ13  JUMPER-SMT_2_NO_SILK  [SMT-JUMPER_2_NO_SILK]  63.1,47.09 90 bottom
SJ14  JUMPER-SMT_2_NC_TRACE_NO-SILK  [SMT-JUMPER_2_NC_TRACE_NO-SILK]  24.16,47.78 180 top
SJ20  SOLDERJUMPERNO  [SJ_2S-NO]  69.59,30.84 0 bottom
SJ21  SOLDERJUMPERNO  [SJ_2S-NO]  69.59,32.84 0 bottom
SJ23  SOLDERJUMPERNO  [SJ_2S-NO]  47.7,28.72 0 bottom
SJ25  SOLDERJUMPERNO  [SJ_2S-NO]  69.36,37.54 180 bottom
SJ26  JUMPER-SMT_2_NC_TRACE_NO-SILK  [SMT-JUMPER_2_NC_TRACE_NO-SILK]  33.56,73.2 180 top
SJ27  JUMPER-SMT_2_NC_TRACE_NO-SILK  [SMT-JUMPER_2_NC_TRACE_NO-SILK]  33.56,70.67 0 top
SJ32  JUMPER-SMT_2_NC_TRACE_NO-SILK  [SMT-JUMPER_2_NC_TRACE_NO-SILK]  33.6,63.01 180 top
SMA  5-1814400-1  [518144001]  109.09,3.56 180 top
STM32F303VE  STM32F303VE  [TQFP100]  66,56.4 90 top
SV2  [MA06-1]  40.95,20.81 0 top
SV3  [MA03-1]  25.88,11.3 270 top
TB1  3.5MM_TB_X6  [3.5MM_X6]  1.4,58.8 0 top
TB2  3.5MM_TB_X6  [3.5MM_X6]  92.84,2.03 90 top
TERM3  3.5MM_TB_X6  [3.5MM_X6]  130.18,67.39 180 top
TP1  TEST-POINTPOGO_PTH  [1X01_NO_SILK]  77.42,64.64 0 top
TP2  TEST-POINTPOGO_PTH  [1X01_NO_SILK]  52.49,58.54 0 top
TP3  TEST-POINTPOGO_PTH  [1X01_NO_SILK]  52.33,65.47 0 top
TP4  TEST-POINTPOGO_PTH  [1X01_NO_SILK]  125.16,15.75 0 top
TP5  TEST-POINTPOGO_PTH  [1X01_NO_SILK]  57.85,64.65 0 top
TP6  TEST-POINTPOGO_PTH  [1X01_NO_SILK]  50.82,61.71 0 top
TP7  TEST-POINTPOGO_PTH  [1X01_NO_SILK]  108.93,50.35 0 top
TP8  TEST-POINTPOGO_PTH  [1X01_NO_SILK]  45.4,57.35 0 top
TP9  TEST-POINTPOGO_PTH  [1X01_NO_SILK]  22.98,24.37 0 top
TP10  TEST-POINTPOGO_PTH  [1X01_NO_SILK]  92.63,66.34 0 top
TP11  TEST-POINTPOGO_PTH  [1X01_NO_SILK]  97.88,65.37 0 top
TP18  TEST-POINTPOGO_PTH  [1X01_NO_SILK]  85.03,75.14 0 top
TP19  TEST-POINTPOGO_PTH  [1X01_NO_SILK]  55.19,76.26 0 top
TP20  TEST-POINTPOGO_PTH  [1X01_NO_SILK]  104.53,70.61 0 top
U1  ESP32-WROOM-32D  [MODULE_ESP32-WROOM-32D]  58.63,32.65 180 bottom
U$2  BOOST_MODULE  [BOOST]  83.42,30.58 270 top
U$7  47219-2001_MICROSD  [47219-2001_MICROSD]  20.43,35.73 270 bottom
USART1  UART1  [MA06-1]  17.83,4.07 0 top
USB-C  CSP-USC16-TR  [USB-C]  125.65,23.85 90 top
VT1  ADC-028-2-T  [DCJACK_2MM_SMT]  130,46.9 180 top

## Tracks (layer width: path | path; a pad name or v marks a point on that pad's centre or on a via)
3PH_BIAS
  Top 0.305: LMV824.13 LMV824.14 | 123.05,77.6 LMV824.14 | 122.67,76.33 LMV824.13 | LMV824.3 119.03,75.06 | 119.03,75.06 arc45 120.83,75.81 | 120.83,75.81 121.28,76.26 arc-45 121.45,76.33 LMV824.13 | LMV824.5 119.75,72.52 | LMV824.10 119.75,72.52 | 119.75,72.52 119.75,73.69 | 119.75,73.69 arc-45 120.5,75.48 120.83,75.81 | 119.75,73.69 arc45 119.3,74.8 119.03,75.06 | LMV824.14 arc-45 123.35,77.9 127.9,77.9 arc-45 128.86,77.5 arc-45 129.31,76.41 129.31,75.78 arc-45 128.6,74.07 TERM3.P$5
  Bottom 0.305: TERM3.P$1 128.54,60 arc45 129.28,61.8 129.28,67.42 | 129.28,67.42 129.28,69.73 arc45 128.71,71.11 TERM3.P$5 | TERM3.P$3 arc45 127.74,65.88 129.28,67.42
+3V3  (via drill 0.5)
  Top 0.254: R33.1 72.38,38.48 v72.38,37.44 | C6.1 60,65.99 STM32F303VE.50 | STM32F303VE.28 71,66.06 | C8.1 | C5.1 56.33,49.16 57.57,50.4 STM32F303VE.75 | v8.53,54.29 8.53,54.94 D21.K | v6.99,56.38 7.32,56.05 D34.K | R20.2 16.19,57.76 arc-45 16.2,57.76 | C3.1 72.83,46.84 v72.43,47.23 72,47.67 STM32F303VE.100
  Top 0.305: C45.1 20.03,25.62 20.03,24.83 20.34,24.52 v20.88,24.52 19.85,24.52 R7.2 | RJ1.2 18.21,42.74 v18.27,42.67 | v18.27,42.67 18.28,42.7 arc-45 R1.2 C40.1 19.75,42.85 19.57,42.67 v18.27,42.67 | v10.7,27.15 RJ2.2
  Top 0.406: MCP1825.3 111.21,37.13 C33.1 | v58.95,67.58 59.46,67.07 C6.1 | v71.02,67.3 71,67.28 C8.1 71,66.06 | v55.16,49.38 55.86,49.38 C5.1 | FB5.2 120.1,17.59 v120.04,17.65 | v110.05,38.06 110.05,37.13 C33.1 | C33.1 arc45 108.41,37.62 | v106.17,38.1 106.62,37.87 | 108.42,37.13 C33.1
  Top 0.5: 16.2,57.76 17.89,56.06 arc-45 18.47,54.66 OLED.3
  Top 0.508: v122.49,35.37 123.82,35.37 R10.2 | R13.2 15.87,57.8 R20.2
  +3V3 0.406: v107.33,38.37 arc-45 106.5,38.08 v106.17,38.1
  +3V3 0.5: v47.26,29.9 46.95,29.59 v46.95,27.58
  Bottom 0.305: 16.54,28.95 U$7.PIN4 19.51,28.95 v19.69,28.76 | 16.54,28.95 16.48,28.89 | 16.54,28.95 12.5,28.95 v10.7,27.15
  Bottom 0.406: SJ23.2 47.21,28.67 47.21,27.84 v46.95,27.58 | v42.62,30.33 41.59,30.33 v41.22,29.96 41.08,29.82 C26.1 41.27,28.83 C25.1 | v42.62,30.33 43.85,30.33 v43.89,30.29 44.89,30.29 | 44.89,30.29 v44.93,30.25 | 44.89,30.29 44.89,29.12 C24.1 C25.1 | C25.1 42.62,29.31 v42.62,30.33 | C25.1
  Bottom 0.5: SJ23.2 47.25,29.89 arc-45 v47.26,29.9
  other vias: 107.03,37.27 106.9,36.09 105.87,36.72 110.06,36.17
  pour +3V3: 138.44,41.4 138.44,0.36 127.28,-10.79 2.92,-10.79 -9.34,1.47 -9.34,71.35 -1.35,79.35 8.87,79.35 50.31,53.1 60.05,59.38 57.69,68.67 60.54,68.87 61.91,66.74 62.32,62.34 63.54,60.55 66.96,60.52 69.56,63.12 69.56,68.15 72.54,68.15 72.54,55.6 76.33,51.81 76.33,47.32 76.23,47.22 76.23,46.2 79.09,43.34 92.82,43.34 101.69,52.21 101.69,66.16 102.61,67.57 105.49,67.57 107.21,65.86 107.21,40.19 106.72,39.7 108.56,37.86 133.4,37.86 134.79,39.25
  pour Top: 111.95,38.76 105.25,38.76 105.25,35.56 105.25,35.37 111.9,35.37
+3V3ANA  (via drill 0.5)
  Top 0.254: v9.44,87.7 D15.K | v22.33,87.12 22.64,87.12 D16.K | v35.05,87.08 35.91,87.66 D19.K | v47.6,87.66 48.64,87.66 D24.K | D20.K 60.98,87.28 v60.6,87.28 | v73.14,87.36 73.79,87.36 D25.K | v85.84,87.39 86.75,87.78 D27.K | v98.54,87.4 99.29,87.4 D28.K | v111.36,87.36 112.29,87.68 D29.K | IC2.5 56.84,59.73 v56.87,59.7 | STM32F303VE.22 75.75,60.9 77.36,62.51 | C13.1 79.25,63.25
  Top 0.305: TP1.1 arc-45 77.51,64.43 | v115.95,73.79 LMV824.4 arc-90 117.23,73.81 v118.53,73.81 | 77.36,62.51 R22.1 | v112.33,58.16 111.88,57.71 111.32,57.71 D4.K
  Top 0.406: v38.89,76.67 39.3,77.08 D2.1 39.48,77.08 v38.92,77.64 | C13.1 78.48,63.65 R22.1 77.42,62.59 TP1.1
  Top 0.508: C43.1 108.42,46.31 | C17.1 79.63,66.04 C13.1
  +3V3 0.178: 38.89,77.61 v38.92,77.64
  +3V3 0.406: v38.89,76.67 38.89,77.61
  +3V3 0.508: v9.44,87.7 10.09,87.05 22.26,87.05 v22.33,87.12 34.28,87.12 v35.05,87.08
  other vias: 111.24,49.14 109.92,46.78 109.83,48.38 111.22,50.45 108.56,47.83
  pour +3V3 (rank 6): -2.78,90.46 -0.14,90.46 11.76,78.55 44.89,65.86 44.48,58.86 57.35,59.33 55.74,70.91 75.63,70.44 75.63,64.74 76.48,63.89 77.96,63.89 83.55,69.48 96.37,69.48 96.99,70.09 105.92,70.09 109.07,66.95 109.07,43.98 111.11,41.94 122.16,41.94 132.53,52.3 132.53,88.82 130.59,90.75 -1.83,90.75 -3.29,92.21
  pour Top: 111.84,45.2 111.84,51.47 107.97,51.47 107.97,45.16 109.95,45.16
+5V  (via drill 0.5)
  Top 0.254: 92.03,35.8 92.03,38.43 v91.76,38.69 | D14.A 90.88,43.08 91.07,43.27 v91.55,43.27
  Top 0.305: RJ2.7 17.47,20.79 19.42,18.84 C47.1 | C42.1 18.36,36.39 RJ1.7 | 28.97,36.22 19.84,36.22 19.25,35.62 | 20.19,17.75 24.51,17.75 28.8,22.05 28.8,26
  Top 0.35: PCB2.P$44 24.43,73.18 arc90 C28.1 21.9,72.65 arc-90 C18.1 C27.1
  Top 0.356: 20.19,17.64 arc45 20.19,17.64 19.87,17.32 16.56,14.01 16.56,8.82 USART1.3
  Top 0.406: 20.19,17.64 20.19,17.75 | 19.95,18.31 20.25,18.01 20.25,18.82 C47.1 | 19.95,18.31 17.47,20.79 | 19.87,17.32 19.95,17.4 19.95,18.31 | v120.07,24.84 120.07,25.77 FB1.2 | 123.09,14.45 124.39,15.75 TP4.1 | C4.1 122.93,14.29 122.87,14.22 122.87,13.13 U$2.IN+ | C51.1 16.56,8.82 | 103.7,36.54 arc45 104.17,37.67 104.17,43.55 arc45 103.43,45.35 JP2.14 103.87,47.39 arc45 104.61,49.19 104.61,63.76 104.19,64.19 FB6.2
  Top 0.5: PCB2.P$42 PCB2.P$44 | 27.02,73.18 arc-90 28.97,71.23 28.97,36.22 28.97,26 | 28.8,26 28.97,26 | 28.97,26 32.7,26 arc90 33.9,27.2 33.9,29.54 | 73.64,35.8 92.03,35.8 101.36,35.8 101.91,35.8 arc45 103.7,36.54
  Top 0.508: U$2.IN+ 123.09,13.25 123.09,14.45 | C12.1 118.53,26.87 119.74,26.87 FB1.2 118.73,27.88 arc45 116.94,28.62 111.11,28.62 arc-45 109.31,29.37 103.62,35.06 arc45 101.83,35.8 101.36,35.8 | 33.9,29.54 arc-45 34.51,31.01 36.94,33.44 67.02,33.44 arc45 68.82,34.19 69.69,35.06 arc-45 71.48,35.8 73.64,35.8 | FB8.2 119.57,46.78 121.19,45.16 121.19,39.31 119.57,37.7 | PCB2.P$44 27.02,73.18 | SV2.3 39.67,22.96 C10.1 39.05,23.32 36.37,26 32.7,26 | C42.1 19.2,35.58 19.25,35.62
  Top 0.813: C15.1 118.43,26.8 C12.1 | FB1.2 120.46,36.81 119.57,37.7 FB9.2
  Bottom 0.254: v91.55,43.27 91.55,38.9 v91.76,38.69
  Bottom 0.406: 101.59,7.76 105.02,11.2 119.74,11.2 121.62,13.08 U$2.IN+ | TP4.1 120.07,20.84 v120.07,24.84
  Bottom 0.508: 101.59,7.76 TB2.P$6
+5V_A
  Top 0.254: 117.48,46.74 FB8.1 | C39.1 117.48,46 117.48,46.74 | 117.48,46.74 117.48,46.92
  Top 0.508: MCP1825(ANALOG).1 117.48,46.92 | FB8.1 117.52,45.96 C39.1
+5V_BATT
  Top 0.305: D14.K 88.1,42.36 C52.1 87.88,42.34 IC_VBAT.3
+5V_D
  Top 0.813: FB9.1 117.02,37.16 MCP1825.1 118.2,34.8 C21.1
+5V_REF
  Top 0.406: FB6.1 100.04,63.79 97.67,63.79 C11.1
  Top 0.508: C11.1 97.22,63.44 97.22,63.5 94.67,63.5 C37.1 90.86,63.36 | 90.86,63.36 REF19X.2 | REF19X.3 90.86,64.33 90.86,63.36
  Top 0.635: 97.22,63.5 97.22,65.01 97.58,65.37 TP11.1
+5V_USB
  Top 0.508: USB-C.A4/B9 125.84,21.45 arc45 126.77,21.83 arc45 127.42,23.42 127.42,24.35 arc45 126.83,25.77 arc45 125.68,26.25 USB-C.B4/A9 122.38,26.25 arc45 FB1.1 arc-45 122.61,25.06 C34.1 arc-45 122.27,24.23 D40.K
+24V
  Top 0.178: U$2.OUT+ 84.43,14.1 R17.2 86.3,15.68 86.9,15.08
  Top 0.254: 86.9,13.93 86.9,9.08 84.15,6.33
  Top 0.3: R9.2 R11.2 86.9,15.08 86.9,13.93
  Top 0.305: TB2.P$1 84.09,6.27 arc-90 84.15,6.33
_AC1
  Top 0.305: 123.8,43.12 VT1.PWR2
  Top 0.406: 115.58,52.66 arc-45 R43.2 arc45 115.58,52.66 | 115.58,52.66 116.86,53.94 | 117.04,54.62 R34.1 arc-45 117.19,54.28 116.86,53.94 | VT1.PWR2 123.8,45.95 arc45 123.06,47.75 116.86,53.94 | 115.58,52.66
AC1
  Top 0.305: 113.93,53.74 R43.1 R53.1 113.76,55.75 111.31,55.75 | 111.31,55.75 R29.1 | D4.A 111.31,56.18 111.31,55.75 | D1.K 111.3,55.73 111.31,55.75
  Top 0.406: R43.1 arc-45 R43.1
AC1_T  (via drill 0.5)
  Top 0.305: R39.1 118.32,63.59 arc-45 115.01,64.96 112.92,67.05 R25.1 arc-45 112.38,71.84 v112.3,71.75 | LMV824.1 115.9,77.6 arc45 v115.82,77.57
  Bottom 0.305: v112.3,71.75 112.3,74.14 115.73,77.57 v115.82,77.57
AC2_T  (via drill 0.5)
  Top 0.305: R26.1 arc-45 113.2,74.89 113.8,74.28 arc-45 113.96,73.9 113.96,68.05 115.78,66.23 arc45 116.92,65.76 118.83,65.76 | 118.83,65.76 arc-45 R40.1 | LMV824.7 117.21,69.2 arc-45 v117.1,68.95 | v117.23,66.49 117.36,66.36 arc45 118.83,65.76
  Bottom 0.305: v117.1,68.95 arc-45 117.23,68.63 v117.23,66.49
AC3_T
  Top 0.305: R27.1 110.88,77.94 arc-45 112.68,77.19 114.15,75.72 arc-45 114.9,73.92 114.9,68.69 115.64,67.95 arc45 116.76,67.48 118.15,67.48 arc45 R41.2 120.37,69.24 arc-45 122.17,69.98 LMV824.8
ADC_2_RJ45IN  (via drill 0.5)
  Top 0.178: STM32F303VE.61 59.71,57.4 59.98,57.13 59.98,56.44 60.53,55.88 60.53,54.45 v60.43,54.34 | v48.57,50.84 48.19,51.21 45.93,51.21
  Top 0.203: 45.93,51.21 44.16,51.21 41.77,48.83 38.3,48.83 35.42,45.95 v35.42,45.3 | v23.47,40.06 23.36,39.95 v23.36,37.38 | v10.58,19.52 RJ2.8
  Bottom 0.178: v60.43,54.34 60.23,54.15 57.48,54.15 55.17,51.84 48.91,51.84 48.57,51.5 v48.57,50.84
  Bottom 0.203: v35.42,45.3 34.31,44.19 34.31,42.28 33.6,41.57 24.97,41.57 v23.47,40.06 | v23.36,37.38 22.63,36.65 22.63,35.07 21.9,34.34 17.09,34.34 13.28,30.53 11.86,30.53 9.07,27.73 9.07,21.03 v10.58,19.52
ADC_RJ45IN  (via drill 0.5)
  Top 0.178: v61.29,52.37 61.29,56.17 61.83,56.71 61.83,58.33 59.23,60.93 | v49.51,51.23 48.92,51.81 46.12,51.81
  Top 0.203: 46.12,51.81 43.79,51.81 41.43,49.46 37.98,49.46 34.47,45.95 v34.47,45.35 | v24.45,43.9 23.86,43.3 v23.86,41.84 | v14.42,34.12 14.42,35.06 RJ1.8 | STM32F303VE.54 59.23,60.93
  Bottom 0.178: v61.29,52.37 61.29,52.23 60.39,51.33 49.61,51.33 v49.51,51.23
  Bottom 0.203: v34.47,45.35 33.01,43.9 v24.45,43.9 | v23.86,41.84 16.13,34.12 v14.42,34.12
AGND  (via drill 0.5)
  Top 0.254: 60.01,72.95 CF6.1 | 50.16,73 CF8.1 | IC2.2 55.26,62.54 v55.24,62.56
  Top 0.305: v42.62,65.68 42.59,65.65 | C50.2 44.42,65.15 | v121.35,73.81 122.62,73.81 arc-90 LMV824.11 124.03,73.79 arc-90 v124.05,73.77
  Top 0.406: 90.9,68.62 90.91,68.61 SJ1.1 89.74,67.63 89.73,67.64
  Top 0.508: FB3.2 112.92,22.62 arc45 v112.87,22.6 112.87,23.25 | FB3.2 113.31,23.52 arc45 v112.96,23.66 | FB3.2 arc-45 113.98,23.16 | 113.98,23.16 v113.98,23.95 | 112.87,23.25 112.87,23.47 arc-45 v112.96,23.66 | v112.96,23.66 113.3,23.66 arc45 v113.98,23.95 | v113.98,23.95 113.64,23.95 arc45 v112.96,23.66 | v112.96,23.66 arc-45 113.85,23.3 113.98,23.16 | FB3.2 arc-45 113.01,23.11 112.87,23.25
  other vias: 5.13,96.32 15.39,100.54 28.01,100.67 41.16,100.4 52.47,100.8 65.62,100.8 78.24,100.54 91.39,100.8 104.41,100.14 117.3,100.8 74.08,66.88 55.93,68.03 71.69,59.69 70.49,59.82 83.02,65.33 82.71,66.81 84.82,59.64 85.85,59.66 56.65,66.09 20.53,79.07 130.2,49.11 116.46,40.66 113.56,42.7 110.83,40.59 119.81,40.63 120.26,41.58 118.81,41.16 117.01,42.92 118.73,49.12 120.25,47.54 113.47,44.68 113.61,48.82 114.65,48.82 112.57,48.79 114.57,44.66 112.34,44.54 108.42,42.45 110.08,44.06 110.13,42.26 125.11,88.62 113.22,78.67 111.07,83.29 98.44,83.21 85.67,83.29 72.97,83.33 60.15,83.33 47.37,83.33 34.71,83.25 22.01,83.25 9.43,83.41 65.54,62.55 58.72,72.92 53.7,72.93 48.69,72.97 43.61,72.97 63.68,72.93 68.61,73.01 73.62,72.93 78.43,72.97 83.6,72.97 77.8,59.6 82.16,60.01 82.69,64.13 122.18,43.21 68.26,66.84 128.07,54.51 91.22,77.17 48.94,56.05 51.43,59.91 39.77,68.28 59.84,59.24 61.25,60.1 16.62,94.62 29.31,94.68 42.32,95.33 54.74,94.68 67.36,94.49 80.05,94.22 92.73,94.49 105.42,94.29 118.43,94.42 9.66,90.88 110.67,60.93 123.74,79.38 100.82,75.07 103.88,73.21 100.52,70.96 109.18,74.24 106.61,76.75 102.53,78.4 120.43,71.31 45.44,61.28 119.36,76.67 111.82,69.35 130.8,55.08 129.77,96.33 127.29,67.43 39.38,74.86 40.8,73.28 76.2,59.56 44.66,59.45 110.06,53.46 115.44,42.75 111.26,42.67 127.04,74.44 112.42,64.11 101.47,68.61 122.75,68.92 91.7,68.77 88.75,66.81
  pour GND (rank 6): 8.15,121.68 116.38,121.68 arc-90 139.77,98.29 139.77,47.44 arc-90 132.96,40.63 112.58,40.63 arc-90 108.88,44.33 108.88,65.73 arc90 105.45,69.16 93.39,69.16 arc90 90.97,66.74 90.97,60.66 arc-90 89.1,58.8 46.85,58.8 arc-90 46.01,59.63 46.01,63.68 arc90 43,66.7 38.6,66.7 arc-90 36.44,68.85 36.44,73.7 arc90 32.61,77.53 13.6,77.53 arc-90 7.61,83.51 7.61,91.88 arc90 6.3,93.19 3.11,93.19 arc-90 -3.2,99.5 -3.2,117.5 arc-90 4.02,124.71
  pour Top (isolate 0.203, rank 6): -7.06,121.68 116.38,121.68 arc-90 139.77,98.29 139.77,47.44 arc-90 132.36,40.04 110.51,40.04 arc-90 107.95,42.59 107.95,68.19 92.42,68.19 arc90 90.97,66.74 90.97,60.66 arc-90 89.51,59.2 46.09,59.2 arc-90 43.87,61.42 arc90 38.6,66.7 arc-90 36.44,68.85 36.44,73.7 arc90 32.61,77.53 13.6,77.53 arc-90 7.61,83.51 7.61,86.58 arc90 -1.76,95.95 -1.76,116.38 arc-90
  pour Top (isolate 0.254): 46.1,59.61 54.66,60.09 51.67,56.4 46.08,55.98
  pour GND: 47.44,60.09 54.68,60.09 54.68,56.71 54.68,56.42 47.3,56.42
  pour Bottom (isolate 0.203, rank 6): 8.15,121.68 116.38,121.68 arc-90 139.77,98.29 139.77,47.44 arc-90 132.36,40.04 110.51,40.04 arc-90 107.95,42.59 107.95,68.19 92.42,68.19 arc90 90.97,66.74 90.97,60.66 arc-90 89.4,59.1 47.03,59.1 arc-90 43.86,62.26 arc90 39.43,66.7 38.6,66.7 arc-90 36.44,68.85 36.44,73.7 arc90 32.61,77.53 13.6,77.53 arc-90 7.61,83.51 7.61,91.88 arc90 6.3,93.19 3.11,93.19 arc-90 -3.2,99.5 -3.2,117.5 arc-90 4.02,124.71
  pour GND (isolate 0.305, rank 3): 109.99,46.62 arc-90 110.13,46.77 120.12,46.77 arc-90 121.16,45.72 121.16,39.95 121.16,38.29 arc-90 119.88,37.02 arc90 118.13,35.26 118.13,32.76 118.13,24.57 arc-90 115.05,21.49 112.45,21.49 arc-90 110.18,23.76 110.18,35.36 arc90 109.09,36.45 arc-90 108.38,37.16 108.38,45.91
  pour Bottom (isolate 0.254): 43.8,62.19 43.93,56.32 47.4,55.25 50.53,55.33 55.9,58.93 56.62,60.35
  pour Top (isolate 0.254): 43.13,64.46 43.98,56.25 45.87,55.58 51.38,56.04 57.02,57.77 56.71,60.37 54.69,60.66
ANT
  Top 0.406: C48.1 109.1,10.52
  Top 1.524: 109.1,10.52 109.1,11.35 arc-90 RFM69HCW.8 | 109.1,10.52 SMA.1
BIAS  (via drill 0.5)
  Top 0.254: 43.26,66.5 39.05,66.5 arc-90 37.35,68.2 37.35,74.71 37.35,74.94 arc90 33.98,78.31 25.7,78.31 arc-90 24.03,79.98 arc90 22.62,81.39 10.27,81.39 arc-90 8.13,83.53 8.13,96.07 | 130,88.8 130,88.98 C36.1 | 24,104.32 CT8.P$1 24,104.48 arc-90 24.13,104.61 | CT7.P$1 36.7,104.4 arc-90 36.91,104.61 | CT6.P$1 49.4,104.45 arc-90 49.55,104.61 | CT4.P$1 74.8,104.38 arc-90 75.03,104.61 | CT3.P$1 87.5,104.39 arc-90 87.72,104.61 | CT2.P$1 100.2,104.35 arc-90 100.46,104.61 | JP11.1 82.56,90.5 82.2,90.5 | C35.1 43.26,68.03 43.26,66.5 | CT5.P$1 62.1,104.52 arc90 62.01,104.61 | 11.11,104.49 CT9.P$1 arc90 10.99,104.61 10.03,104.61 | 43.26,66.5 54.28,66.5 54.93,66.5 arc45 56.4,67.11 v56.97,67.68 | 54.42,64.64 R6.2 | TP3.1 49.33,65.47 R38.1 46.57,65.04 R23.2 | CT1.P$1 113.21,104.61 112.92,104.61 arc90 112.9,104.59 CT1.P$1 | 130,60.6 130,60.64 130.02,60.64 130,60.6
  Top 0.305: 130,60.64 130,88.8 | 130,59.65 arc-45 128.64,56.38 128.13,55.87 arc-45 126.34,55.12 R34.2 | 130,59.65 130,60.6 | 121.51,98.61 arc-45 121.93,97.59 121.93,91.71 R42.1 121.38,91.5 JP10.1 | 96.62,98.61 96.73,98.61 | 83.98,98.61 84.02,98.61 | 20.53,98.61 20.51,98.61 | 33.23,98.61 33.27,98.61 | 45.56,98.61 45.66,98.61 | 58.51,98.61 58.41,98.61 | 71.18,98.61 71.08,98.61 | CT5.P$1 62.1,99.18 arc-45 61.86,98.61 | 108.85,98.61 109.12,98.61 R44.1 107.93,91.62 JP12.1 | JP14.1 95.25,91.56 R45.1 96.45,98.61 95.97,98.61 | 82.95,98.61 83.72,98.61 R48.1 82.58,91.43 JP11.1 | 70.18,98.61 71.04,98.61 R47.1 69.87,91.23 JP13.1 | JP15.1 57.13,91.23 R46.1 58.22,98.61 57.3,98.61 | JP18.1 44.24,91.32 R49.1 45.43,98.61 44.69,98.61 | 32.44,98.61 32.98,98.61 R50.1 31.82,91.38 JP17.1 | JP16.1 19.21,91.46 R51.1 20.3,98.61 19.41,98.61 | v114.35,58.56 arc-45 113.98,57.67 R53.2 | CT9.P$1 11.3,98.64 arc-45 11.29,98.61 | R6.2 54.14,64.51 arc-45 52.69,65.11 TP3.1 | v124,75.03 arc45 123.93,75.06 LMV824.12 arc-45 LMV824.12 v121.31,75.06 | VT1.GND 130,52.47 130,59.65
  Top 0.356: 130,88.8 arc90 120.19,98.61 | 8.13,96.07 arc-90 10.68,98.61 11.29,98.61 19.41,98.61 20.51,98.61 24,98.61 | 120.19,98.61 112.9,98.61 | 112.9,98.61 108.85,98.61 100.2,98.61 | 100.2,98.61 96.73,98.61 95.97,98.61 87.5,98.61 | 87.5,98.61 84.02,98.61 82.95,98.61 74.8,98.61 | 74.8,98.61 71.08,98.61 70.18,98.61 61.86,98.61 58.41,98.61 57.3,98.61 49.4,98.61 | 49.4,98.61 45.66,98.61 44.69,98.61 36.7,98.61 | 36.7,98.61 33.27,98.61 32.44,98.61 24,98.61 | CT8.P$1 24,98.61 | CT7.P$1 36.7,98.61 | CT6.P$1 49.4,98.61 | CT4.P$1 74.8,98.61 | CT3.P$1 87.5,98.61 | CT2.P$1 100.2,98.61 | CT1.P$1 112.9,98.61 | 121.51,98.61 120.19,98.61
  Top 0.406: R53.2 114,57.34 116.71,57.34 arc-45 120.34,55.83 R34.2 122.55,52.92 arc45 VT1.GNDBREAK 129.83,52.4 arc45 130,52.47 | D2.2 37.28,76.88 37.28,75.18 D3.1 37.48,74.71 37.35,74.71 | R6.2 54.29,66.47 arc45 54.28,66.5
  Bottom 0.254: v56.97,67.68 59.77,70.47 arc-45 63.52,72.01 99.41,72.01 arc45 101.2,72.75 102.07,73.62 arc-45 103.44,74.19 106.27,74.19 arc-45 108.06,73.44
  Bottom 0.305: 108.06,73.44 108.91,72.59 | 108.91,72.59 109.94,71.57 arc-45 110.68,69.77 110.68,64.65 arc45 111.42,62.86 113.6,60.68 arc-45 114.35,58.88 v114.35,58.56 | 108.91,72.59 115.17,78.85 arc-45 116.08,79.22 117.42,79.22 arc-45 119.05,78.55 121.31,76.28 | v121.31,75.06 121.31,76.28 | 121.31,76.28 121.82,75.78 arc45 123.62,75.03 v124,75.03
BOOT0_RPI
  Top 0.178: PCB2.P$47 32.02,68.1 32.43,67.69 32.43,67.64 J1.2
BOOT_STM  (via drill 0.5)
  Top 0.178: R2.1 69.42,39.2 v68.73,39.2 | v71.05,34.03 71.05,33.35 72.63,31.76 75.47,31.76 76.45,32.75 v80.82,32.75
  Top 0.203: R2.1 69.73,42.6 69,43.34 STM32F303VE.94 69,51.55 v66.16,54.39 | v35.27,65.31 34.62,65.96 J1.1
  Bottom 0.178: v68.73,39.2 69.63,39.2 70.37,38.46 70.37,34.71 v71.05,34.03 | v80.82,32.75 80.82,29.89 82.25,28.46 89.15,28.46 94.42,23.19 94.42,14.47 95.33,13.57 99.51,13.57 105.15,19.21 109.8,19.21 | 118.39,15.22 123.53,15.22 128.04,10.71 BOOT_STM.1
  Bottom 0.203: v35.27,65.31 35.88,65.31 41.56,59.63 41.56,56.57 44.61,53.52 53.84,53.52 56.33,56.01 59.68,56.01 61.24,54.45 66.1,54.45 v66.16,54.39 | 109.8,19.21 111.11,20.52 111.11,22.92 112.78,24.58 114.24,24.58 114.27,24.55 114.83,24.55 115.7,23.68 115.7,21.66 118.39,18.98 118.39,15.22
BUTTON1
  Top 0.178: PCB2.P$53 31.75,60.48 33.02,60.48 SJ3.1 33.16,61.44 34,61.44 34.97,62.41 34.97,63.61 34.41,64.18 30.32,64.18 30.01,64.48
  Top 0.203: S1.2 2.74,73.86 16.54,73.86 19.49,76.82 27.85,76.82 30.01,74.65 30.01,64.48 | 31.29,60.48 PCB2.P$53
BUTTON1_STM  (via drill 0.5)
  Top 0.178: STM32F303VE.53 v56.96,61.4 v56.96,61.39 | v40.09,63.27 39.62,63.74 36.51,63.74 35.46,62.69 35.46,61.88 SJ3.2
  Bottom 0.178: v56.96,61.39 55.81,60.23 55.81,57.97 51.71,53.87 | v40.09,63.27 40.2,63.16 40.2,61.85 41.65,60.4
  Bottom 0.203: 41.65,60.4 41.93,60.11 41.93,56.94 45,53.87 51.71,53.87
CAN_RX  (via drill 0.5)
  Top 0.178: 75.61,41.99 80.09,37.51 80.09,36.98
  Top 0.203: v75.73,43.29 75.61,43.17 75.61,41.99 | 80.09,36.98 80.43,36.63 88.31,36.63 96.28,44.61 96.28,51.01 99.04,53.77 JP2.7 | v63,51.39 62.5,50.89 STM32F303VE.81
  Bottom 0.203: v75.73,43.29 75.65,43.29 74.27,44.67 74.27,47.28 70.56,50.99 63.39,50.99 v63,51.39
CAN_TX  (via drill 0.5)
  Top 0.203: v76.18,44.31 76.38,44.11 76.38,41.71 79.53,38.55 89.33,38.55 95.66,44.88 95.66,51.88 JP2.5
  Top 0.254: STM32F303VE.82 63,50.32 v64.31,51.69
  Bottom 0.203: v76.18,44.31 76.09,44.4 75.14,44.4 74.71,44.83 74.71,47.59 70.89,51.41 64.6,51.41 v64.31,51.69
CT1
  Top 0.254: RF1.2 86.73,72.97 arc90 CF1.2 | CF1.2 86.75,72.35 arc-90 84.41,70.01 70.24,70.01 arc90 67.5,67.27 STM32F303VE.35 | CF1.2 86.75,73.42 TP18.1
  Top 0.305: TP18.1 86.6,75.14 arc45 RF1.2
CT2
  Top 0.254: RF2.2 81.76,72.97 arc90 CF2.2 arc-90 79.38,70.55 69.63,70.55 arc90 67,67.92 STM32F303VE.36
CT3
  Top 0.254: RF3.2 arc-90 76.81,75.18 CF3.2 76.81,72.94 arc-90 74.97,71.11 69.25,71.11 arc90 66,67.86 STM32F303VE.38
CT4
  Top 0.254: RF4.2 CF4.2 arc90 CF4.2 arc-90 70.58,71.69 68.62,71.69 arc90 65.5,68.57 STM32F303VE.39
CT5
  Top 0.254: RF5.2 66.89,72.92 CF5.2 66.95,72.86 66.95,72.15 arc90 65,70.2 STM32F303VE.40
CT6
  Top 0.254: RF6.2 CF6.2 61.89,71.29 arc90 62.31,70.86 arc-90 64.5,68.67 STM32F303VE.41
CT7
  Top 0.254: CF7.2 RF7.2 arc-45 55.78,75.66 TP19.1 | CF7.2 56.91,72.56 | CF7.2 56.91,72.27 arc90 59.09,70.09 61.46,70.09 arc-90 64,67.55 STM32F303VE.42
CT8
  Top 0.254: RF8.2 CF8.2 51.94,71.9 arc90 54.48,69.36 60.96,69.36 arc-90 63.5,66.82 STM32F303VE.43
CT9
  Top 0.254: RF9.2 CF9.2 46.97,71.33 arc90 49.51,68.79 60.46,68.79 arc-90 63,66.25 STM32F303VE.44
CT_IN1
  Top 0.254: RF1.1 86.73,78.15 arc-90 89.27,80.69 113.1,80.69 arc90 115.64,83.23 RB1A.1
  Top 0.356: CT1.P$2 112.9,90.71 arc45 113.64,88.91 RB1B.1 | D29.A 113.82,87.69 arc-45 115.61,86.94 RB1B.1 | D13.K arc45 115.32,83.95 RB1A.1 115.64,85.64 | RB1B.1 115.64,86.34 115.64,85.64 | RB1_.1 115.64,85.64
CT_IN2
  Top 0.254: RF2.1 81.76,79.14 arc-90 84.01,81.39 100.31,81.39 arc90 102.86,83.93 RB2A.1
  Top 0.356: CT2.P$2 100.2,90.62 arc45 100.94,88.83 RB2B.1 | D28.A arc-45 102.81,86.97 RB2B.1 | D12.K arc45 102.5,83.91 RB2A.1 102.86,85.64 | RB2B.1 102.86,86.01 102.86,85.64 | RB2_.1 102.86,85.64
CT_IN3
  Top 0.254: RF3.1 76.79,78.06 arc-90 80.94,82.2 88.28,82.2 arc90 RB3A.1
  Top 0.356: CT3.P$2 87.5,90.82 arc45 88.24,89.02 RB3B.1 | D27.A 88.53,87.69 arc-45 90.32,86.94 RB3B.1 | D11.K 88.33,83.31 arc45 90.13,84.05 RB3A.1 90.35,85.64 | RB3B.1 90.35,85.96 90.35,85.64 | RB3_.1 90.35,85.64
CT_IN4
  Top 0.254: RB4A.1 77.45,83.84 | 77.45,83.84 77.45,83.74 | RF4.1 71.83,79.23 arc-90 74.36,81.77 75.37,81.77 arc90 77.45,83.84
  Top 0.356: CT4.P$2 74.8,90.62 arc45 75.54,88.83 RB4B.1 | D25.A D25.A arc-45 77.43,86.94 RB4B.1 | D10.K arc45 77.12,83.94 RB4A.1 77.45,85.64 | RB4B.1 77.45,85.99 77.45,85.64 | RB4_.1 77.45,85.64
CT_IN5
  Top 0.254: CT5.P$2 62.52,94.28 | 64.81,84.08 64.81,82.85 arc45 65.56,81.06 66.11,80.5 arc-45 66.86,78.7 RF5.1
  Top 0.356: RB5_.1 64.81,85.64 RB5B.1 | RB5B.1 RB5A.1 | RB5A.1 64.81,84.08 | CT5.P$2 62.1,90.68 arc45 62.84,88.89 RB5B.1 | D20.A 62.99,87.69 arc-45 64.79,86.94 RB5B.1 | D9.K arc45 64.54,84 RB5A.1
CT_IN6
  Top 0.254: RF6.1 61.89,79.3 arc90 59.35,81.84 53.94,81.84 arc-90 52.14,83.64 RB6A.1
  Top 0.356: CT6.P$2 49.4,90.71 arc45 50.14,88.91 RB6B.1 | D24.A 50.32,87.69 arc-45 52.12,86.94 RB6B.1 | D8.K arc45 51.91,84.04 RB6A.1 52.14,85.35 52.14,85.64 | 52.14,85.64 RB6B.1 | RB6_.1 52.14,85.64
CT_IN7
  Top 0.254: RF7.1 56.92,78.46 arc90 54.38,81 41.91,81 arc-90 39.37,83.54 39.37,84.18 RB7A.1
  Top 0.356: 39.37,85.63 RB7B.1 39.35,86.94 | 39.37,85.63 39.37,84.18 39.35,84.18 arc45 37.55,83.43 D7.K | 39.35,86.94 arc45 37.55,87.69 D19.A | CT7.P$2 36.7,90.64 arc45 37.44,88.85 39.35,86.94 | 39.37,85.63 RB7_.1
CT_IN8
  Top 0.254: RF8.1 51.95,77.55 arc90 49.41,80.09 29.27,80.09 arc-90 26.73,82.63 26.73,84.18 RB8A.1
  Top 0.356: CT8.P$2 24,90.7 arc45 24.74,88.9 RB8B.1 | D16.A 24.91,87.69 arc-45 26.7,86.94 RB8B.1 | D6.K 26.73,84.18 | RB8A.1 26.73,85.64 | 26.73,85.64 RB8B.1 | RB8_.1 26.73,85.64
CT_IN9
  Top 0.254: RF9.1 arc90 44.68,79.19 30.56,79.19 27.51,79.19 arc-90 25.33,81.37 arc90 24.45,82.25 16.09,82.25 arc-90 RB9A.1
  Top 0.356: CT9.P$2 11.3,90.74 arc45 12.04,88.95 RB9B.1 | RB9B.1 14.07,85.61 | 14.07,85.61 RB9A.1 13.86,84.05 arc-45 12.06,83.31 D5.K | D15.A 12.25,87.69 arc-45 14.05,86.94 RB9B.1 | RB9_.1 14,85.64 arc-45 14.07,85.61
DGND  (via drill 0.5)  (157 unrouted)
  Top 0.203: 14.45,41.44 RJ1.3
  Top 0.254: 71.5,49.56 STM32F303VE.99 71.5,50.24 65.73,56.01 65.73,56.03 65.71,56.02 | 16.5,38.93 RJ1.5 10.86,38.93 v10.57,38.65 | 11.79,25.87 RJ2.3 10.76,25.87 10.65,25.75 | C40.2 arc45 18.01,44.01 RJ1.1 10.56,44.01 10.56,42.83 v10.51,42.78 10.6,42.69 10.6,41.44 14.45,41.44 | RJ2.5 v10.68,23.33 10.65,23.36 | C6.2 60.5,65.87 STM32F303VE.49 60.5,62.04 | C8.2 72.66,66.17 71.5,65.01 STM32F303VE.27 71.5,62.74 | C5.2 56.61,50.9 STM32F303VE.74 61.03,50.9 65.71,55.59 65.71,56.02 | 65.71,56.02 65.71,56.83 | v88.89,55.7 88.22,55.7 | C22.2 90.66,11.23 v90.05,11.84
  Top 0.3: v92.29,28.15 arc-90 92.25,28.19 R16.1 92.25,29.51 | v90.97,23.26 arc-90 91,23.23 R14.1 arc90 88.65,19.9 R15.1 | Q3.2 83.72,20.35 arc-90 v83.96,20.11 | 0.84,81.6 LED3.C 0.91,81.7 0.91,85.36 LED2.C LED1.C | C19.2 6.97,58.62
  Top 0.305: C45.2 18.9,28.45 16.54,28.45 | C41.2 21.26,37.67 v21.68,37.26 | PCB2.P$70 24.94,40.16 arc-45 v24.82,40.21 | PCB2.P$74 25.04,35.08 arc45 v24.78,34.97 | v33.07,28.03 31.75,27.48 PCB2.P$79 | PCB2.P$65 32.86,45.24 arc45 v32.95,45.28 | PCB2.P$60 25.62,52.86 arc-45 v24.83,52.53 | PCB2.P$49 32.1,65.56 arc45 v32.97,65.92 | PCB2.P$54 25.05,60.48 arc45 v24.85,60.39 | PCB2.P$46 24.94,70.64 arc-45 v24.86,70.67 arc45 24.18,70.95 | 60.5,62.04 65.71,56.83 | 65.73,56.97 71.5,62.74
  Top 0.35: 129.82,30.55 S2.1
  Top 0.406: v22.9,19.85 21.92,20.83 C46.2
  Top 0.5: v22.9,19.85 21.93,18.88 C47.2 | C27.2 C18.2 arc-45 22.04,70.95 v23.08,70.95 C28.2 24.18,70.95 arc-45 24.94,70.64 | v24.86,70.67 26.07,70.67 arc-45 PCB2.P$46
  Bottom 0.254: U1.39 58.02,34.26 v57.97,34.38
  Bottom 0.406: C26.2 43.08,26.94 arc-45 C25.2 | C25.2 arc-45 C25.2 | C25.2 C24.2 | 48.42,26.93 arc45 48.97,27.16 arc-45 49.54,27.39 U1.1
  Bottom 0.5: U1.38 66.18,27.39 arc-45 64.38,28.14 U1.39 58.27,35.54 arc-45 60.07,36.28 U1.31 | U1.15 52.9,43.08 arc45 54.09,40.21 57.39,36.91 v57.39,36.82 | U1.1 51.35,27.39 arc45 52.62,27.92 58.15,33.45 v58.15,35.59
  other vias: 65.68,57.45 126.52,37.41 59.43,34.53 55.95,36.85 59.2,36.84 87.94,55.75 59.37,35.67 65.23,56.54 23.59,21.86 66.19,56.54 10.56,25.74 19.74,46.92 33.08,27.17 25.84,33.97 27.3,40.12 30.48,45.16 32.97,65.07 27.36,70.59 110.78,31.55 112.79,32.93 110.81,30.06 129.49,32.07 77.09,34.14 89.4,20.89 10.65,35.88 22,35.33 0.9,84.07 20.02,32.96 87.64,32.7 111.43,32.86 112.92,21.49 112.93,20.59 56.92,35.7 56.64,34.44 55.78,35.27 44.22,25.64 41.83,25.68 43,25.62 55.16,50.45 65.74,55.52 59.71,32.57 58.62,32.51 57.18,32.51 55.7,32.53 73.44,43.68 89.71,52.73 87.4,45.6 39.43,44.22 65.37,36.15 29.85,33.74 27.95,37.61 27.98,46.29 27.86,58.98 73.87,37.04 36.88,50.91 120.56,5.17 120.83,6.26 119.58,6.04 29.78,49.58 29.75,40.68 109.91,33.7 108.47,33.54 107.22,33.94 119.04,31.03 119,30.11 118.05,30.72 102.67,20.31 105.06,24.2 90.13,40.85 45.45,50.27 41.7,62 11.58,55 98.45,60.12 95.75,59.9 114.68,37.81 112.45,36.62 116.23,30.42 116.33,31.51 115.08,32.93 93.44,58.71 95.9,65.05 85.06,37.3
  pour Top (isolate 0.203, rank 6): 132.69,38.66 109.48,38.66 arc-90 105.68,42.45 105.68,65.53 arc90 104.43,66.77 94.1,66.77 arc90 93.12,65.79 93.12,60.68 arc-90 90.39,57.95 57.99,57.95 arc90 56.97,56.94 arc-90 55.12,55.08 46.39,54.64 arc-90 42.32,58.71 42.42,60.05 arc90 37.27,65.53 37.04,65.53 arc-90 34.5,68.07 34.5,72.71 arc90 31.31,75.9 7.94,75.9 arc-90 5.35,78.5 5.35,88.21 arc90 2.81,90.75 -2.13,90.75 arc90 -7.42,85.46 -7.42,-0.27 arc90 31.97,-39.66 164.26,9.62 arc90 136.69,37.19
  pour GND (isolate 0.203, rank 6): 133.12,39.08 arc-90 132.69,38.66 109.48,38.66 arc-90 105.68,42.45 105.68,65.53 arc90 104.43,66.77 94.1,66.77 arc90 93.12,65.79 93.12,60.68 arc-90 90.44,58 58.04,58 arc90 56.97,56.94 arc-90 55.08,55.05 47.23,55.05 arc-90 44.72,57.56 44.72,62.82 arc90 42,65.53 37.04,65.53 arc-90 34.5,68.07 34.5,72.71 arc90 31.31,75.9 7.94,75.9 arc-90 5.35,78.5 5.35,88.21 arc90 2.81,90.75 -2.13,90.75 arc90 -2.24,90.64 -2.24,-5.45 arc90 7.15,-14.84 120.38,-14.84 arc90 139.44,4.21 139.44,34.44 arc90 136.69,37.19
  pour Bottom (isolate 0.203, rank 6): 133.29,38.75 arc-90 132.86,38.32 109.64,38.32 arc-90 105.84,42.12 105.84,65.2 arc90 104.6,66.44 94.26,66.44 arc90 93.28,65.46 93.28,60.35 arc-90 90.6,57.67 58.2,57.67 arc90 57.14,56.61 arc-90 55.25,54.72 46.79,54.72 arc-90 43.09,58.41 43.09,59.69 arc90 37.49,65.28 37.12,65.28 arc-90 34.66,67.74 34.66,72.38 arc90 31.47,75.57 8.11,75.57 arc-90 5.51,78.17 5.51,87.88 arc90 2.97,90.42 -1.96,90.42 arc90 -2.08,90.3 -2.08,-5.78 arc90 7.31,-15.17 120.55,-15.17 arc90 139.6,3.88 139.6,34.11 arc90 136.85,36.86
DIO0_RFM  (via drill 0.5)
  Top 0.178: v71.3,45.45 71,45.75 STM32F303VE.98 | v97.38,23.12 97.29,23.03 RFM69HCW.2
  Bottom 0.178: v71.3,45.45 71.3,44.83 74.2,41.92 82.12,41.92 97.38,26.66 v97.38,23.12
DS18B20_RJ45  (via drill 0.5)
  Top 0.178: TP9.1 21.41,22.8 R7.1